# EAGLE design pcbqr_v3_error_as_made (EAGLE 5.11)

## Sheet 1 of 2
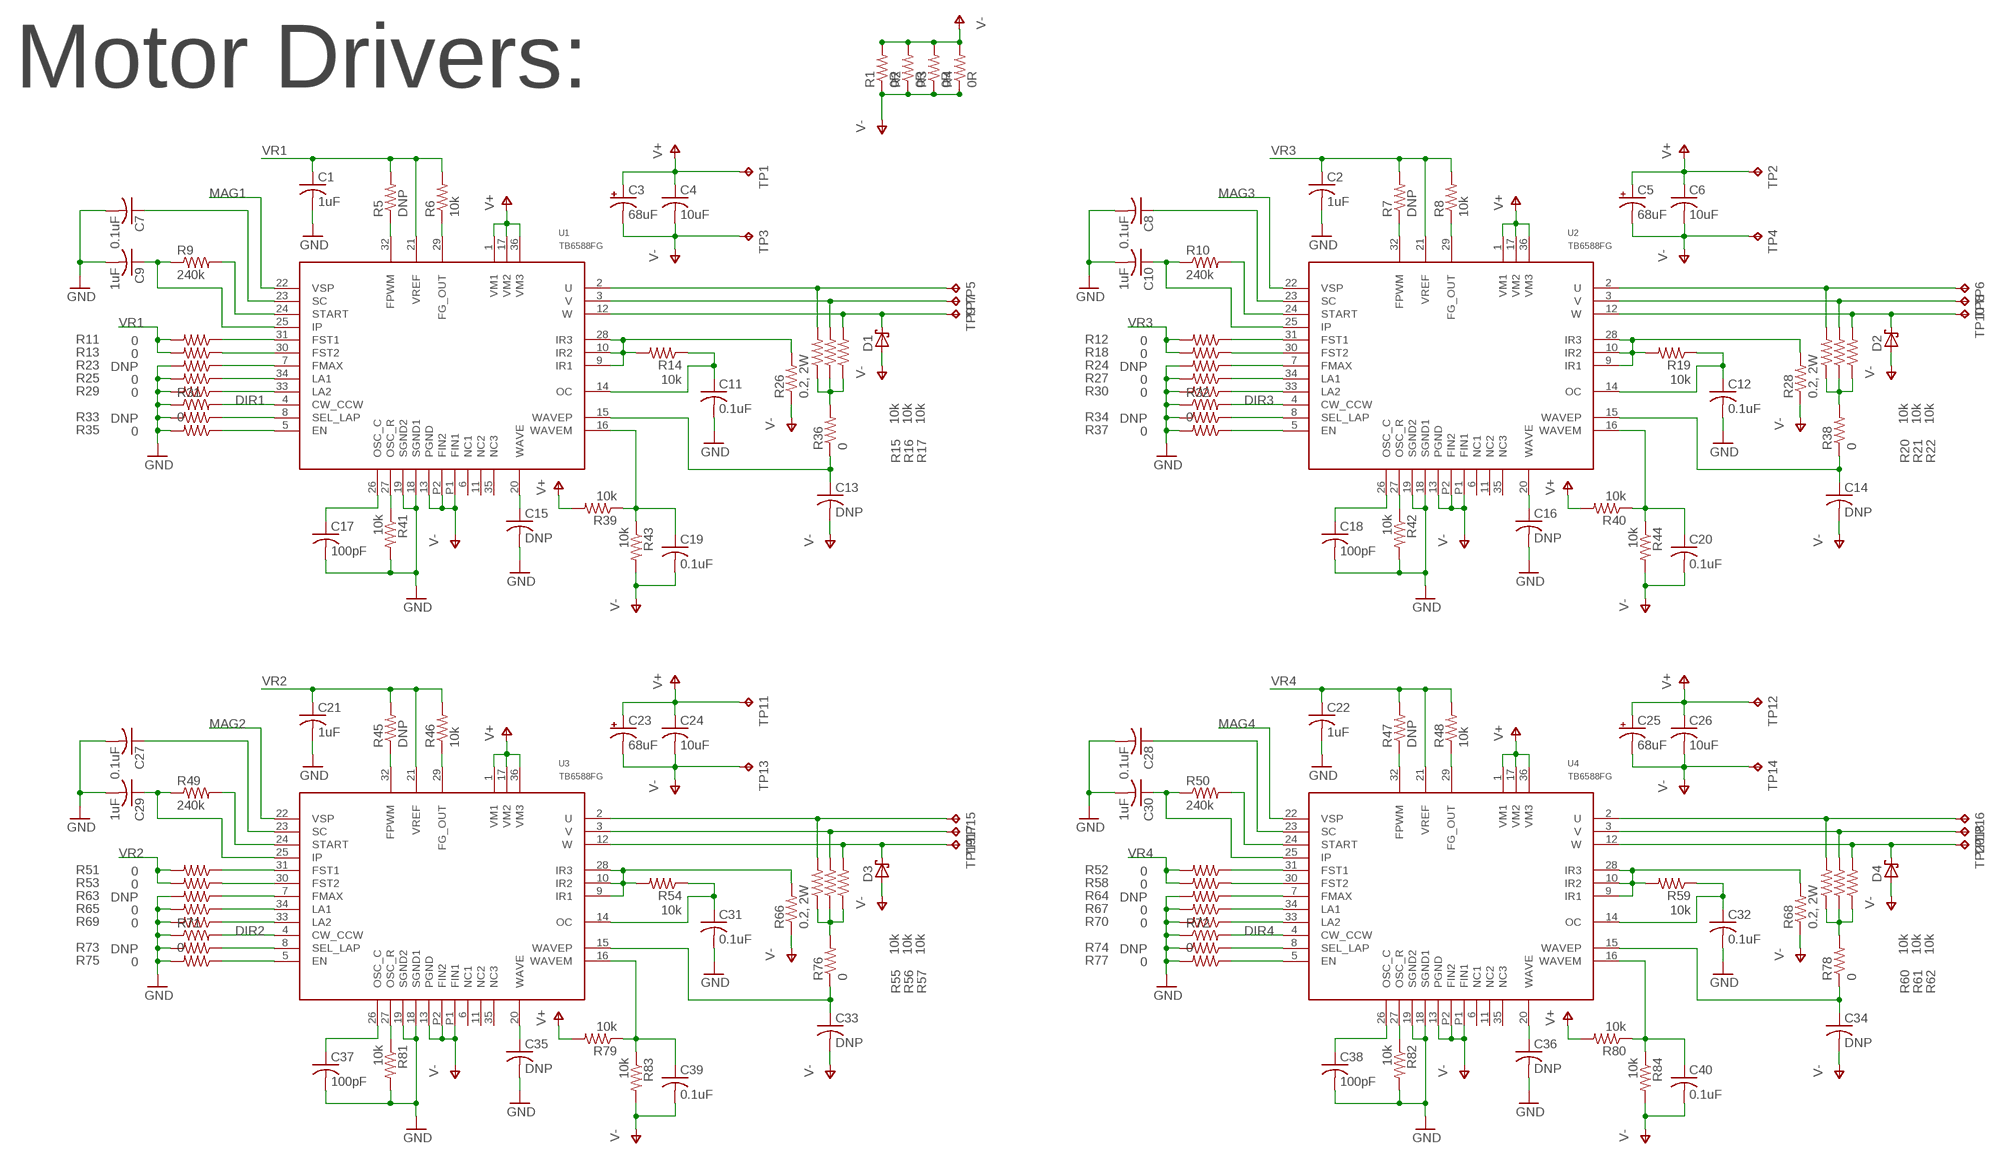
[diagram p0: schematic, sheet 1]

### Parts
C1  1uF  C-USC0603  [C0603]
C2  1uF  C-USC0603  [C0603]
C3  68uF  CPOL-USD  [PANASONIC_D]
C4  10uF  C-USC1206  [C1206]
C5  68uF  CPOL-USD  [PANASONIC_D]
C6  10uF  C-USC1206  [C1206]
C7  0.1uF  C-USC0603  [C0603]
C8  0.1uF  C-USC0603  [C0603]
C9  1uF  C-USC0603  [C0603]
C10  1uF  C-USC0603  [C0603]
C11  0.1uF  C-USC0603  [C0603]
C12  0.1uF  C-USC0603  [C0603]
C13  DNP  C-USC0603  [C0603]
C14  DNP  C-USC0603  [C0603]
C15  DNP  C-USC0603  [C0603]
C16  DNP  C-USC0603  [C0603]
C17  100pF  C-USC0603  [C0603]
C18  100pF  C-USC0603  [C0603]
C19  0.1uF  C-USC0603  [C0603]
C20  0.1uF  C-USC0603  [C0603]
C21  1uF  C-USC0603  [C0603]
C22  1uF  C-USC0603  [C0603]
C23  68uF  CPOL-USD  [PANASONIC_D]
C24  10uF  C-USC1206  [C1206]
C25  68uF  CPOL-USD  [PANASONIC_D]
C26  10uF  C-USC1206  [C1206]
C27  0.1uF  C-USC0603  [C0603]
C28  0.1uF  C-USC0603  [C0603]
C29  1uF  C-USC0603  [C0603]
C30  1uF  C-USC0603  [C0603]
C31  0.1uF  C-USC0603  [C0603]
C32  0.1uF  C-USC0603  [C0603]
C33  DNP  C-USC0603  [C0603]
C34  DNP  C-USC0603  [C0603]
C35  DNP  C-USC0603  [C0603]
C36  DNP  C-USC0603  [C0603]
C37  100pF  C-USC0603  [C0603]
C38  100pF  C-USC0603  [C0603]
C39  0.1uF  C-USC0603  [C0603]
C40  0.1uF  C-USC0603  [C0603]
D1  SCHOTTKY_SMA  [SMA]
D2  SCHOTTKY_SMA  [SMA]
D3  SCHOTTKY_SMA  [SMA]
D4  SCHOTTKY_SMA  [SMA]
R1  0R  R-US_R1210  [R1210]
R2  0R  R-US_R1210  [R1210]
R3  0R  R-US_R2010  [R2010]
R4  0R  R-US_R2010  [R2010]
R5  DNP  R-US_R0603  [R0603]
R6  10k  R-US_R0603  [R0603]
R7  DNP  R-US_R0603  [R0603]
R8  10k  R-US_R0603  [R0603]
R9  240k  R-US_R0603  [R0603]
R10  240k  R-US_R0603  [R0603]
R11  0  R-US_R0603  [R0603]
R12  0  R-US_R0603  [R0603]
R13  0  R-US_R0603  [R0603]
R14  10k  R-US_R0603  [R0603]
R15  10k  R-US_R0603  [R0603]
R16  10k  R-US_R0603  [R0603]
R17  10k  R-US_R0603  [R0603]
R18  0  R-US_R0603  [R0603]
R19  10k  R-US_R0603  [R0603]
R20  10k  R-US_R0603  [R0603]
R21  10k  R-US_R0603  [R0603]
R22  10k  R-US_R0603  [R0603]
R23  DNP  R-US_R0603  [R0603]
R24  DNP  R-US_R0603  [R0603]
R25  0  R-US_R0603  [R0603]
R26  0.2, 2W  R-US_R2512  [R2512]
R27  0  R-US_R0603  [R0603]
R28  0.2, 2W  R-US_R2512  [R2512]
R29  0  R-US_R0603  [R0603]
R30  0  R-US_R0603  [R0603]
R31  0  R-US_R0603  [R0603]
R32  0  R-US_R0603  [R0603]
R33  DNP  R-US_R0603  [R0603]
R34  DNP  R-US_R0603  [R0603]
R35  0  R-US_R0603  [R0603]
R36  0  R-US_R0603  [R0603]
R37  0  R-US_R0603  [R0603]
R38  0  R-US_R0603  [R0603]
R39  10k  R-US_R0603  [R0603]
R40  10k  R-US_R0603  [R0603]
R41  10k  R-US_R0603  [R0603]
R42  10k  R-US_R0603  [R0603]
R43  10k  R-US_R0603  [R0603]
R44  10k  R-US_R0603  [R0603]
R45  DNP  R-US_R0603  [R0603]
R46  10k  R-US_R0603  [R0603]
R47  DNP  R-US_R0603  [R0603]
R48  10k  R-US_R0603  [R0603]
R49  240k  R-US_R0603  [R0603]
R50  240k  R-US_R0603  [R0603]
R51  0  R-US_R0603  [R0603]
R52  0  R-US_R0603  [R0603]
R53  0  R-US_R0603  [R0603]
R54  10k  R-US_R0603  [R0603]
R55  10k  R-US_R0603  [R0603]
R56  10k  R-US_R0603  [R0603]
R57  10k  R-US_R0603  [R0603]
R58  0  R-US_R0603  [R0603]
R59  10k  R-US_R0603  [R0603]
R60  10k  R-US_R0603  [R0603]
R61  10k  R-US_R0603  [R0603]
R62  10k  R-US_R0603  [R0603]
R63  DNP  R-US_R0603  [R0603]
R64  DNP  R-US_R0603  [R0603]
R65  0  R-US_R0603  [R0603]
R66  0.2, 2W  R-US_R2512  [R2512]
R67  0  R-US_R0603  [R0603]
R68  0.2, 2W  R-US_R2512  [R2512]
R69  0  R-US_R0603  [R0603]
R70  0  R-US_R0603  [R0603]
R71  0  R-US_R0603  [R0603]
R72  0  R-US_R0603  [R0603]
R73  DNP  R-US_R0603  [R0603]
R74  DNP  R-US_R0603  [R0603]
R75  0  R-US_R0603  [R0603]
R76  0  R-US_R0603  [R0603]
R77  0  R-US_R0603  [R0603]
R78  0  R-US_R0603  [R0603]
R79  10k  R-US_R0603  [R0603]
R80  10k  R-US_R0603  [R0603]
R81  10k  R-US_R0603  [R0603]
R82  10k  R-US_R0603  [R0603]
R83  10k  R-US_R0603  [R0603]
R84  10k  R-US_R0603  [R0603]
TP1  TPTP20SQ  [TP20SQ]
TP2  TPTP20SQ  [TP20SQ]
TP3  TPTP20SQ  [TP20SQ]
TP4  TPTP20SQ  [TP20SQ]
TP5  TPTP20SQ  [TP20SQ]
TP6  TPTP20SQ  [TP20SQ]
TP7  TPTP20SQ  [TP20SQ]
TP8  TPTP20SQ  [TP20SQ]
TP9  TPTP20SQ  [TP20SQ]
TP10  TPTP20SQ  [TP20SQ]
TP11  TPTP20SQ  [TP20SQ]
TP12  TPTP20SQ  [TP20SQ]
TP13  TPTP20SQ  [TP20SQ]
TP14  TPTP20SQ  [TP20SQ]
TP15  TPTP20SQ  [TP20SQ]
TP16  TPTP20SQ  [TP20SQ]
TP17  TPTP20SQ  [TP20SQ]
TP18  TPTP20SQ  [TP20SQ]
TP19  TPTP20SQ  [TP20SQ]
TP20  TPTP20SQ  [TP20SQ]
U1  TB6588FG  [HSOP36-P-450-0.65]
U2  TB6588FG  [HSOP36-P-450-0.65]
U3  TB6588FG  [HSOP36-P-450-0.65]
U4  TB6588FG  [HSOP36-P-450-0.65]

### Nets
DIR1: R31.2 U1.4(CW_CCW)
DIR2: R71.2 U3.4(CW_CCW)
DIR3: R32.2 U2.4(CW_CCW)
DIR4: R72.2 U4.4(CW_CCW)
GND: C1.2 C2.2 C7.2 C8.2 C9.2 C10.2 C11.2 C12.2 C15.2 C16.2 C17.2 C18.2 C21.2 C22.2 C27.2 C28.2 C29.2 C30.2 C31.2 C32.2 C35.2 C36.2 C37.2 C38.2 R23.2 R24.2 R25.2 R27.2 R29.2 R30.2 R31.1 R32.1 R33.2 R34.2 R35.2 R37.2 R41.2 R42.2 R63.2 R64.2 R65.2 R67.2 R69.2 R70.2 R71.1 R72.1 R73.2 R74.2 R75.2 R77.2 R81.2 R82.2 U1.18(SGND1) U1.19(SGND2) U2.18(SGND1) U2.19(SGND2) U3.18(SGND1) U3.19(SGND2) U4.18(SGND1) U4.19(SGND2) ; also sheet 2
MAG1: U1.22(VSP) ; also sheet 2
MAG2: U3.22(VSP) ; also sheet 2
MAG3: U2.22(VSP) ; also sheet 2
MAG4: U4.22(VSP) ; also sheet 2
N$3: R15.1 R16.1 R17.1 R36.2
N$4: R14.2 R26.2 U1.9(IR1) U1.10(IR2) U1.28(IR3)
N$5: R15.2 TP5.TP U1.2(U)
N$6: R16.2 TP7.TP U1.3(V)
N$7: D1.C R17.2 TP9.TP U1.12(W)
N$8: R35.1 U1.5(EN)
N$9: R33.1 U1.8(SEL_LAP)
N$10: R9.2 U1.24(START)
N$11: R29.1 U1.33(LA2)
N$12: R25.1 U1.34(LA1)
N$13: R23.1 U1.7(FMAX)
N$14: C17.1 U1.26(OSC_C)
N$15: R41.1 U1.27(OSC_R)
N$16: R13.1 U1.30(FST2)
N$17: R11.1 U1.31(FST1)
N$18: C9.1 R9.1 U1.25(IP)
N$19: R5.1 U1.32(FPWM)
N$20: C7.1 U1.23(SC)
N$21: R6.1 U1.29(FG_OUT)
N$22: C19.1 R39.1 R43.1 U1.16(WAVEM)
N$23: R54.2 R66.2 U3.9(IR1) U3.10(IR2) U3.28(IR3)
N$24: C13.1 R36.1 U1.15(WAVEP)
N$25: C11.1 R14.1 U1.14(OC)
N$26: C15.1 U1.20(WAVE)
N$27: R55.2 TP15.TP U3.2(U)
N$28: R56.2 TP17.TP U3.3(V)
N$29: D3.C R57.2 TP19.TP U3.12(W)
N$30: R75.1 U3.5(EN)
N$31: R73.1 U3.8(SEL_LAP)
N$32: R69.1 U3.33(LA2)
N$33: R65.1 U3.34(LA1)
N$34: R63.1 U3.7(FMAX)
N$35: C37.1 U3.26(OSC_C)
N$36: R81.1 U3.27(OSC_R)
N$37: R53.1 U3.30(FST2)
N$38: R51.1 U3.31(FST1)
N$39: R49.2 U3.24(START)
N$40: C29.1 R49.1 U3.25(IP)
N$41: C27.1 U3.23(SC)
N$42: R45.1 U3.32(FPWM)
N$43: R46.1 U3.29(FG_OUT)
N$44: R55.1 R56.1 R57.1 R76.2
N$45: C33.1 R76.1 U3.15(WAVEP)
N$46: C31.1 R54.1 U3.14(OC)
N$47: C39.1 R79.1 R83.1 U3.16(WAVEM)
N$48: C35.1 U3.20(WAVE)
N$49: R19.2 R28.2 U2.9(IR1) U2.10(IR2) U2.28(IR3)
N$50: R20.2 TP6.TP U2.2(U)
N$51: R21.2 TP8.TP U2.3(V)
N$52: D2.C R22.2 TP10.TP U2.12(W)
N$53: R37.1 U2.5(EN)
N$54: R34.1 U2.8(SEL_LAP)
N$55: R30.1 U2.33(LA2)
N$56: R27.1 U2.34(LA1)
N$57: R24.1 U2.7(FMAX)
N$58: C18.1 U2.26(OSC_C)
N$59: R42.1 U2.27(OSC_R)
N$60: R18.1 U2.30(FST2)
N$61: R12.1 U2.31(FST1)
N$62: R10.2 U2.24(START)
N$63: C10.1 R10.1 U2.25(IP)
N$64: C8.1 U2.23(SC)
N$65: R7.1 U2.32(FPWM)
N$66: R8.1 U2.29(FG_OUT)
N$67: R20.1 R21.1 R22.1 R38.2
N$68: C14.1 R38.1 U2.15(WAVEP)
N$69: C12.1 R19.1 U2.14(OC)
N$70: C20.1 R40.1 R44.1 U2.16(WAVEM)
N$71: C16.1 U2.20(WAVE)
N$72: R59.2 R68.2 U4.9(IR1) U4.10(IR2) U4.28(IR3)
N$73: R60.2 TP16.TP U4.2(U)
N$74: R61.2 TP18.TP U4.3(V)
N$75: D4.C R62.2 TP20.TP U4.12(W)
N$76: R77.1 U4.5(EN)
N$77: R74.1 U4.8(SEL_LAP)
N$78: R70.1 U4.33(LA2)
N$79: R67.1 U4.34(LA1)
N$80: R64.1 U4.7(FMAX)
N$81: C38.1 U4.26(OSC_C)
N$82: R82.1 U4.27(OSC_R)
N$83: R58.1 U4.30(FST2)
N$84: R52.1 U4.31(FST1)
N$85: R50.2 U4.24(START)
N$86: C30.1 R50.1 U4.25(IP)
N$87: C28.1 U4.23(SC)
N$88: R47.1 U4.32(FPWM)
N$89: R48.1 U4.29(FG_OUT)
N$90: R60.1 R61.1 R62.1 R78.2
N$91: C34.1 R78.1 U4.15(WAVEP)
N$92: C32.1 R59.1 U4.14(OC)
N$93: C40.1 R80.1 R84.1 U4.16(WAVEM)
N$94: C36.1 U4.20(WAVE)
V+: C3.+ C4.1 C5.+ C6.1 C23.+ C24.1 C25.+ C26.1 R39.2 R40.2 R79.2 R80.2 TP1.TP TP2.TP TP11.TP TP12.TP U1.1(VM1) U1.17(VM2) U1.36(VM3) U2.1(VM1) U2.17(VM2) U2.36(VM3) U3.1(VM1) U3.17(VM2) U3.36(VM3) U4.1(VM1) U4.17(VM2) U4.36(VM3) ; also sheet 2
V-: C3.- C4.2 C5.- C6.2 C13.2 C14.2 C19.2 C20.2 C23.- C24.2 C25.- C26.2 C33.2 C34.2 C39.2 C40.2 D1.A D2.A D3.A D4.A R1.1 R1.2 R2.1 R2.2 R3.1 R3.2 R4.1 R4.2 R26.1 R28.1 R43.2 R44.2 R66.1 R68.1 R83.2 R84.2 TP3.TP TP4.TP TP13.TP TP14.TP U1.13(PGND) U1.P1(FIN1) U1.P2(FIN2) U2.13(PGND) U2.P1(FIN1) U2.P2(FIN2) U3.13(PGND) U3.P1(FIN1) U3.P2(FIN2) U4.13(PGND) U4.P1(FIN1) U4.P2(FIN2) ; also sheet 2
VR1: C1.1 R5.2 R6.2 R11.2 R13.2 U1.21(VREF)
VR2: C21.1 R45.2 R46.2 R51.2 R53.2 U3.21(VREF)
VR3: C2.1 R7.2 R8.2 R12.2 R18.2 U2.21(VREF)
VR4: C22.1 R47.2 R48.2 R52.2 R58.2 U4.21(VREF)
Unconnected: U1.6(NC1) U1.11(NC2) U1.35(NC3) U2.6(NC1) U2.11(NC2) U2.35(NC3) U3.6(NC1) U3.11(NC2) U3.35(NC3) U4.6(NC1) U4.11(NC2) U4.35(NC3)

### Notes on the sheet
- Motor Drivers:

## Sheet 2 of 2
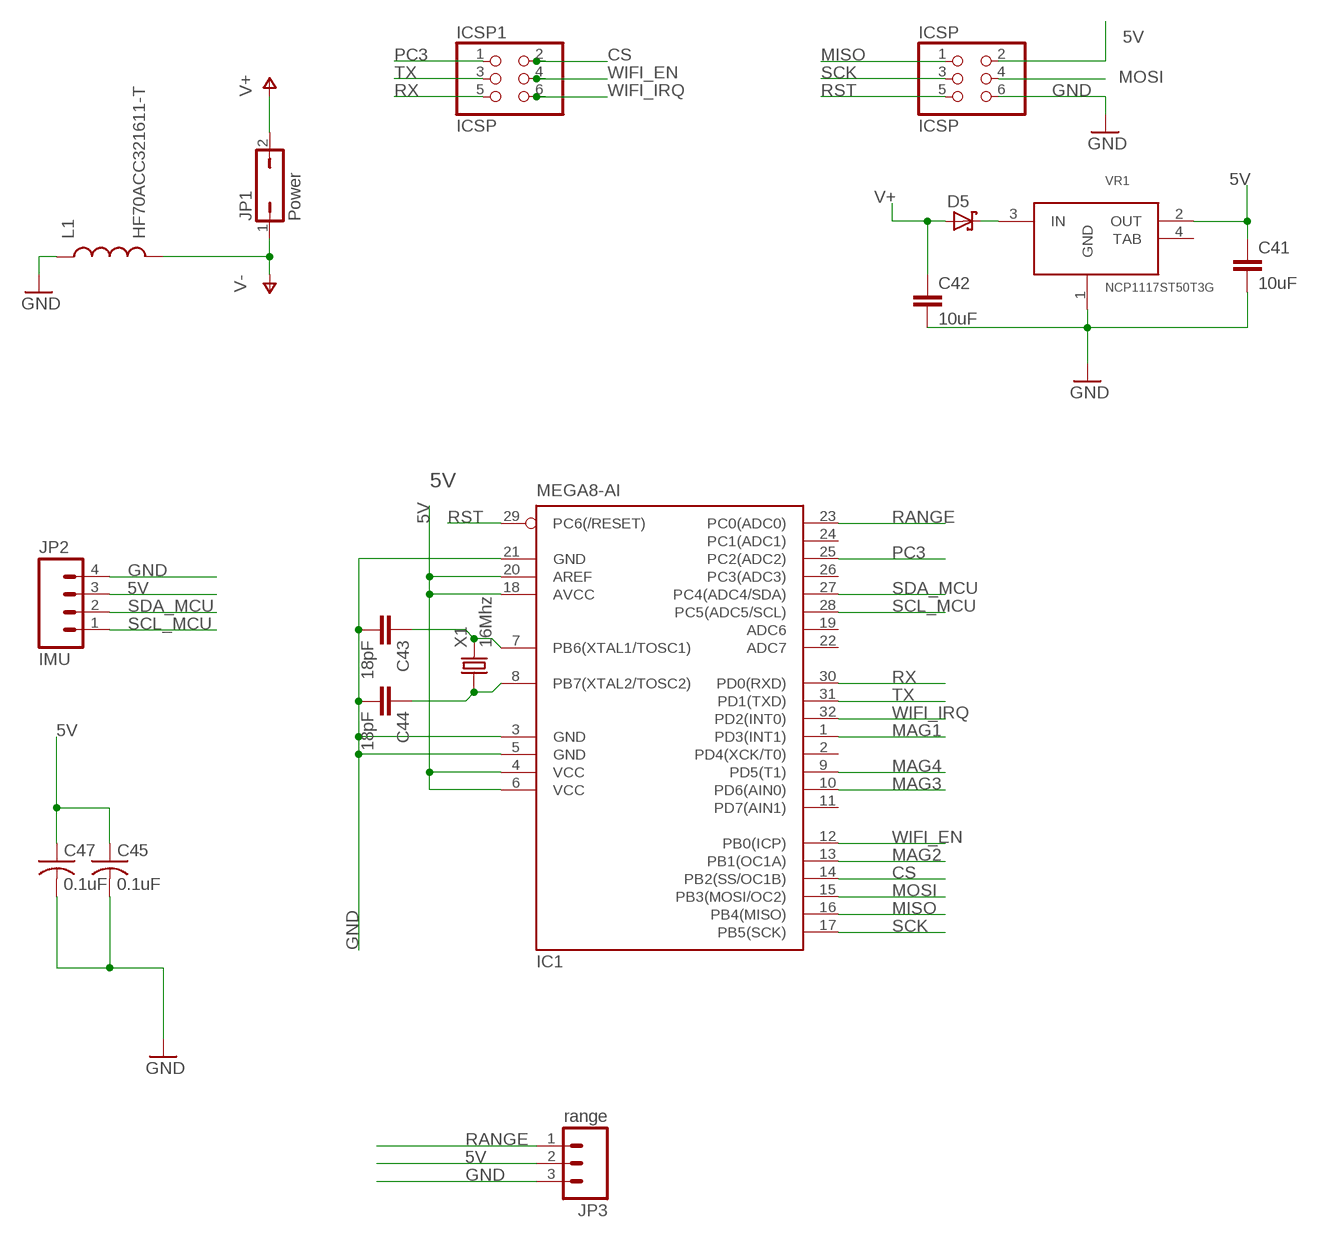
[diagram p1: schematic, sheet 2]

### Parts
C41  10uF  CAP0805  [0805]
C42  10uF  CAP0805  [0805]
C43  18pF  CAP0805  [0805]
C44  18pF  CAP0805  [0805]
C45  0.1uF  C-USC0603  [C0603]
C47  0.1uF  C-USC0603  [C0603]
D5  SCHOTTKY_SMA  [SMA]
IC1  MEGA8-AI  [TQFP32-08]
ICSP  ICSP  PINHD-2X3  [2X03]
ICSP1  ICSP  PINHD-2X3  [2X03]
JP1  Power  JP1Q  [JP1]
JP2  IMU  M04PTH  [1X04]
JP3  range  M03POLAR  [MOLEX-1X3]
L1  HF70ACC321611-T  INDUCTOR1206H*  [INDUCTOR-1206]
VR1  NCP1117ST50T3G  LM1117  [SOT-223]
X1  16Mhz  CRYSTAL-5032  [5032]

### Nets
5V: C41.1 C45.1 C47.1 IC1.4(VCC) IC1.6(VCC) IC1.18(AVCC) IC1.20(AREF) ICSP.2 JP2.3 JP3.2 VR1.2(OUT)
CS: IC1.14(PB2(SS/OC1B)) ICSP1.2
GND: C41.2 C42.2 C43.2 C44.2 C45.2 C47.2 IC1.3(GND) IC1.5(GND) IC1.21(GND) ICSP.6 JP2.4 JP3.3 L1.P$1 VR1.1(GND) ; also sheet 1
MAG1: IC1.1(PD3(INT1)) ; also sheet 1
MAG2: IC1.13(PB1(OC1A)) ; also sheet 1
MAG3: IC1.10(PD6(AIN0)) ; also sheet 1
MAG4: IC1.9(PD5(T1)) ; also sheet 1
MISO: IC1.16(PB4(MISO)) ICSP.1
MOSI: IC1.15(PB3(MOSI/OC2)) ICSP.4
N$2: C43.1 IC1.7(PB6(XTAL1/TOSC1)) X1.2
N$95: C44.1 IC1.8(PB7(XTAL2/TOSC2)) X1.1
N$96: D5.C VR1.3(IN)
PC3: IC1.25(PC2(ADC2)) ICSP1.1
RANGE: IC1.23(PC0(ADC0)) JP3.1
RST: IC1.29(PC6(/RESET)) ICSP.5
RX: IC1.30(PD0(RXD)) ICSP1.5
SCK: IC1.17(PB5(SCK)) ICSP.3
SCL_MCU: IC1.28(PC5(ADC5/SCL)) JP2.1
SDA_MCU: IC1.27(PC4(ADC4/SDA)) JP2.2
TX: IC1.31(PD1(TXD)) ICSP1.3
V+: C42.1 D5.A JP1.2 ; also sheet 1
V-: JP1.1 L1.P$2 ; also sheet 1
WIFI_EN: IC1.12(PB0(ICP)) ICSP1.4
WIFI_IRQ: IC1.32(PD2(INT0)) ICSP1.6
Unconnected: IC1.2(PD4(XCK/T0)) IC1.11(PD7(AIN1)) IC1.19(ADC6) IC1.22(ADC7) IC1.24(PC1(ADC1)) IC1.26(PC3(ADC3)) VR1.4(TAB)

## Library data of the parts
C1 C2 C4 C6-C22 C24 C26-C40 C45 C47 = rcl:C-US: CAPACITOR, American symbol
C3 C5 C23 C25 = rcl:CPOL-US: POLARIZED CAPACITOR, American symbol
C41 C42 = SparkFun:CAP: Capacitor Standard 0603 ceramic capacitor, and 0.1" leaded capacitor.
C43 C44 = slice_noshift:CAP: Capacitor Standard 0603 ceramic capacitor, and 0.1" leaded capacitor.
D1-D5 = sc_usercreated:SCHOTTKY_SMA
IC1 = atmel:MEGA8: MICROCONTROLLER 8 Kbytes FLASH, 1 kbytes SRAM, 512 bytes EEPROM, USART, 6-channel 10 bit ADC, 2-channel 8 bit ADC Pin compatible with Atmega48, ATMega88, ATMega168 Source: avr.lbr; MPN: ATMEGA8-16AU; OC_FARNELL: 9171371; OC_NEWARK: 73M8863
ICSP ICSP1 = pinhead:PINHD-2X3: PIN HEADER
JP1 = jumper:JP1Q: JUMPER
JP2 = SparkFun:M04: Header 4 Standard 4-pin 0.1" header. Use with straight break away headers (SKU : PRT-00116), right angle break away headers (PRT-00553), swiss pins (PRT-00743), machine pins (PRT-00117), and female headers (PRT-00115). Molex polarized connector foot print use with SKU : PRT-08231 with associated crimp pins and housings. 1MM SMD Version SKU: PRT-10208
JP3 = SparkFun:M03: Header 3 Standard 3-pin 0.1" header. Use with straight break away headers (SKU : PRT-00116), right angle break away headers (PRT-00553), swiss pins (PRT-00743), machine pins (PRT-00117), and female headers (PRT-00115). Molex polarized connector foot print use with SKU : PRT-08232 with associated crimp pins and housings.
L1 = SparkFun:INDUCTOR: Inductors Basic Inductor/Choke - 0603 and 1206. Footprints are not proven and vary greatly between part numbers.
R1-R84 = rcl:R-US_: RESISTOR, American symbol
TP1-TP20 = testpad:TP: Test pad
U1-U4 = sc_usercreated:TB6588FG
VR1 = sc_usercreated:LM1117
X1 = NSL_MiniQuad:CRYSTAL*: CRYSTAL

## Net classes
0 default: width 0.203 mm, drill 0.381 mm, clearance 0.203 mm
1 power: width 0.254 mm, drill 0.381 mm, clearance 0.203 mm
3 usbvcc: width 0.508 mm, drill 0.381 mm, clearance 0.203 mm

## Board
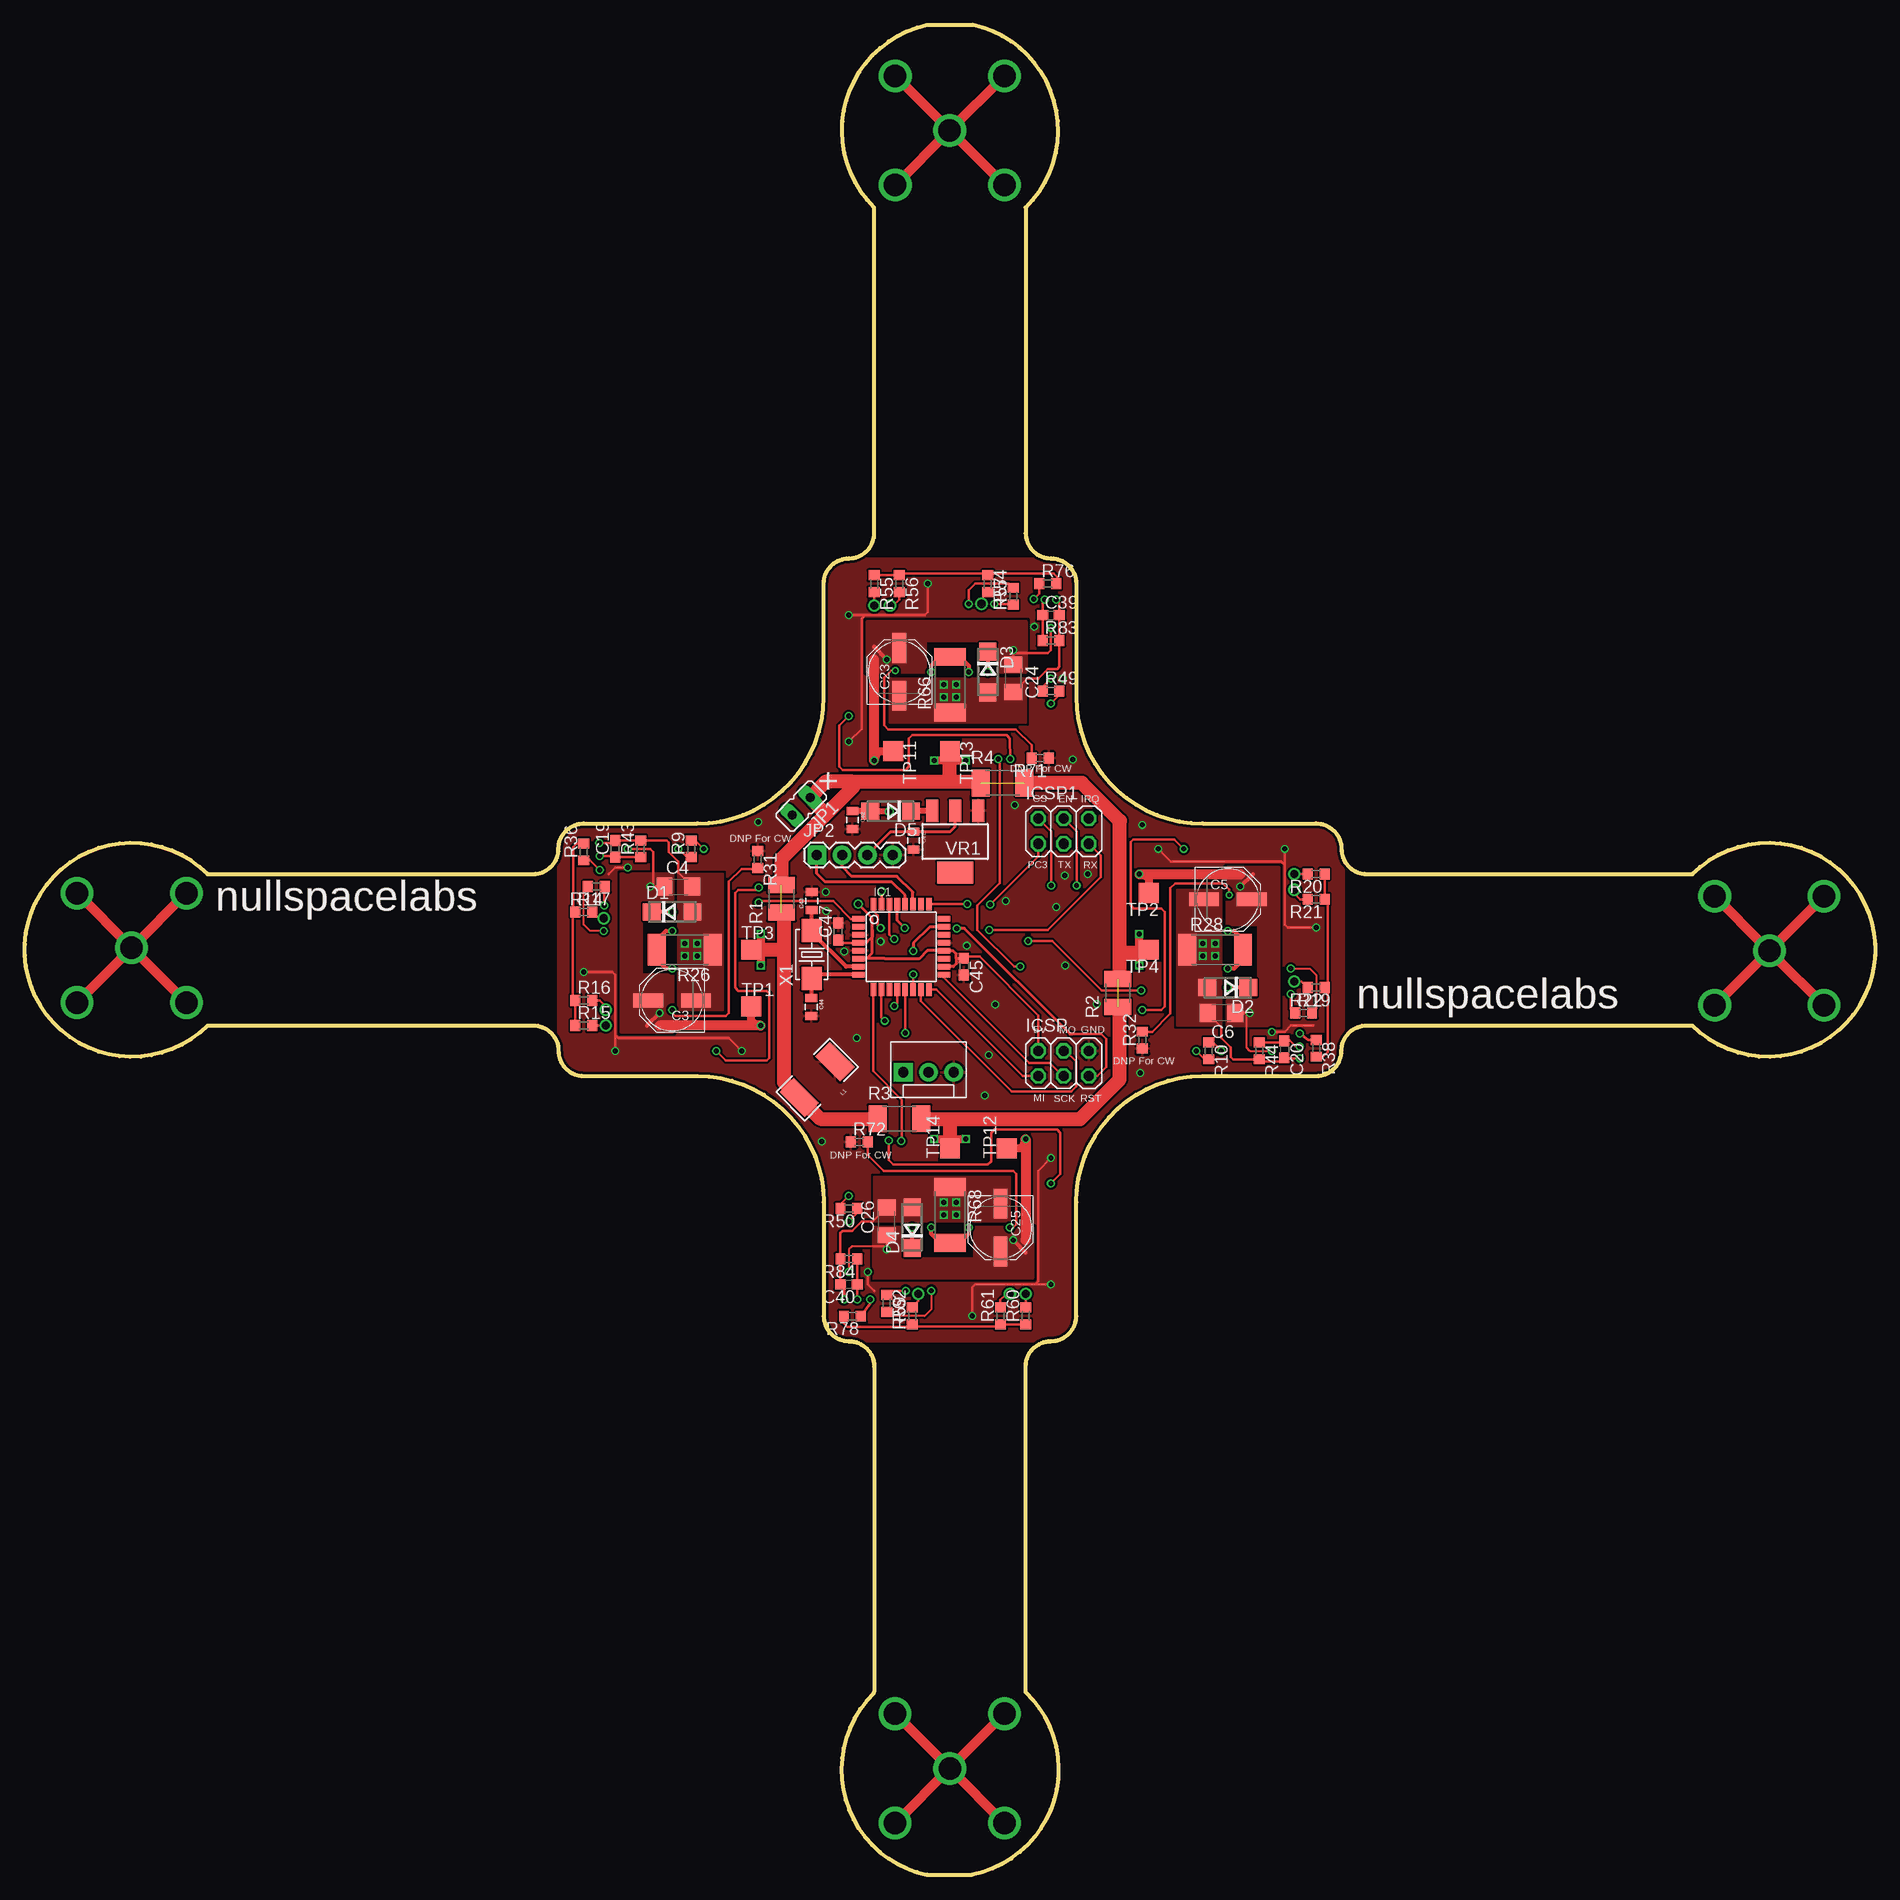
[diagram p2: board, top side]
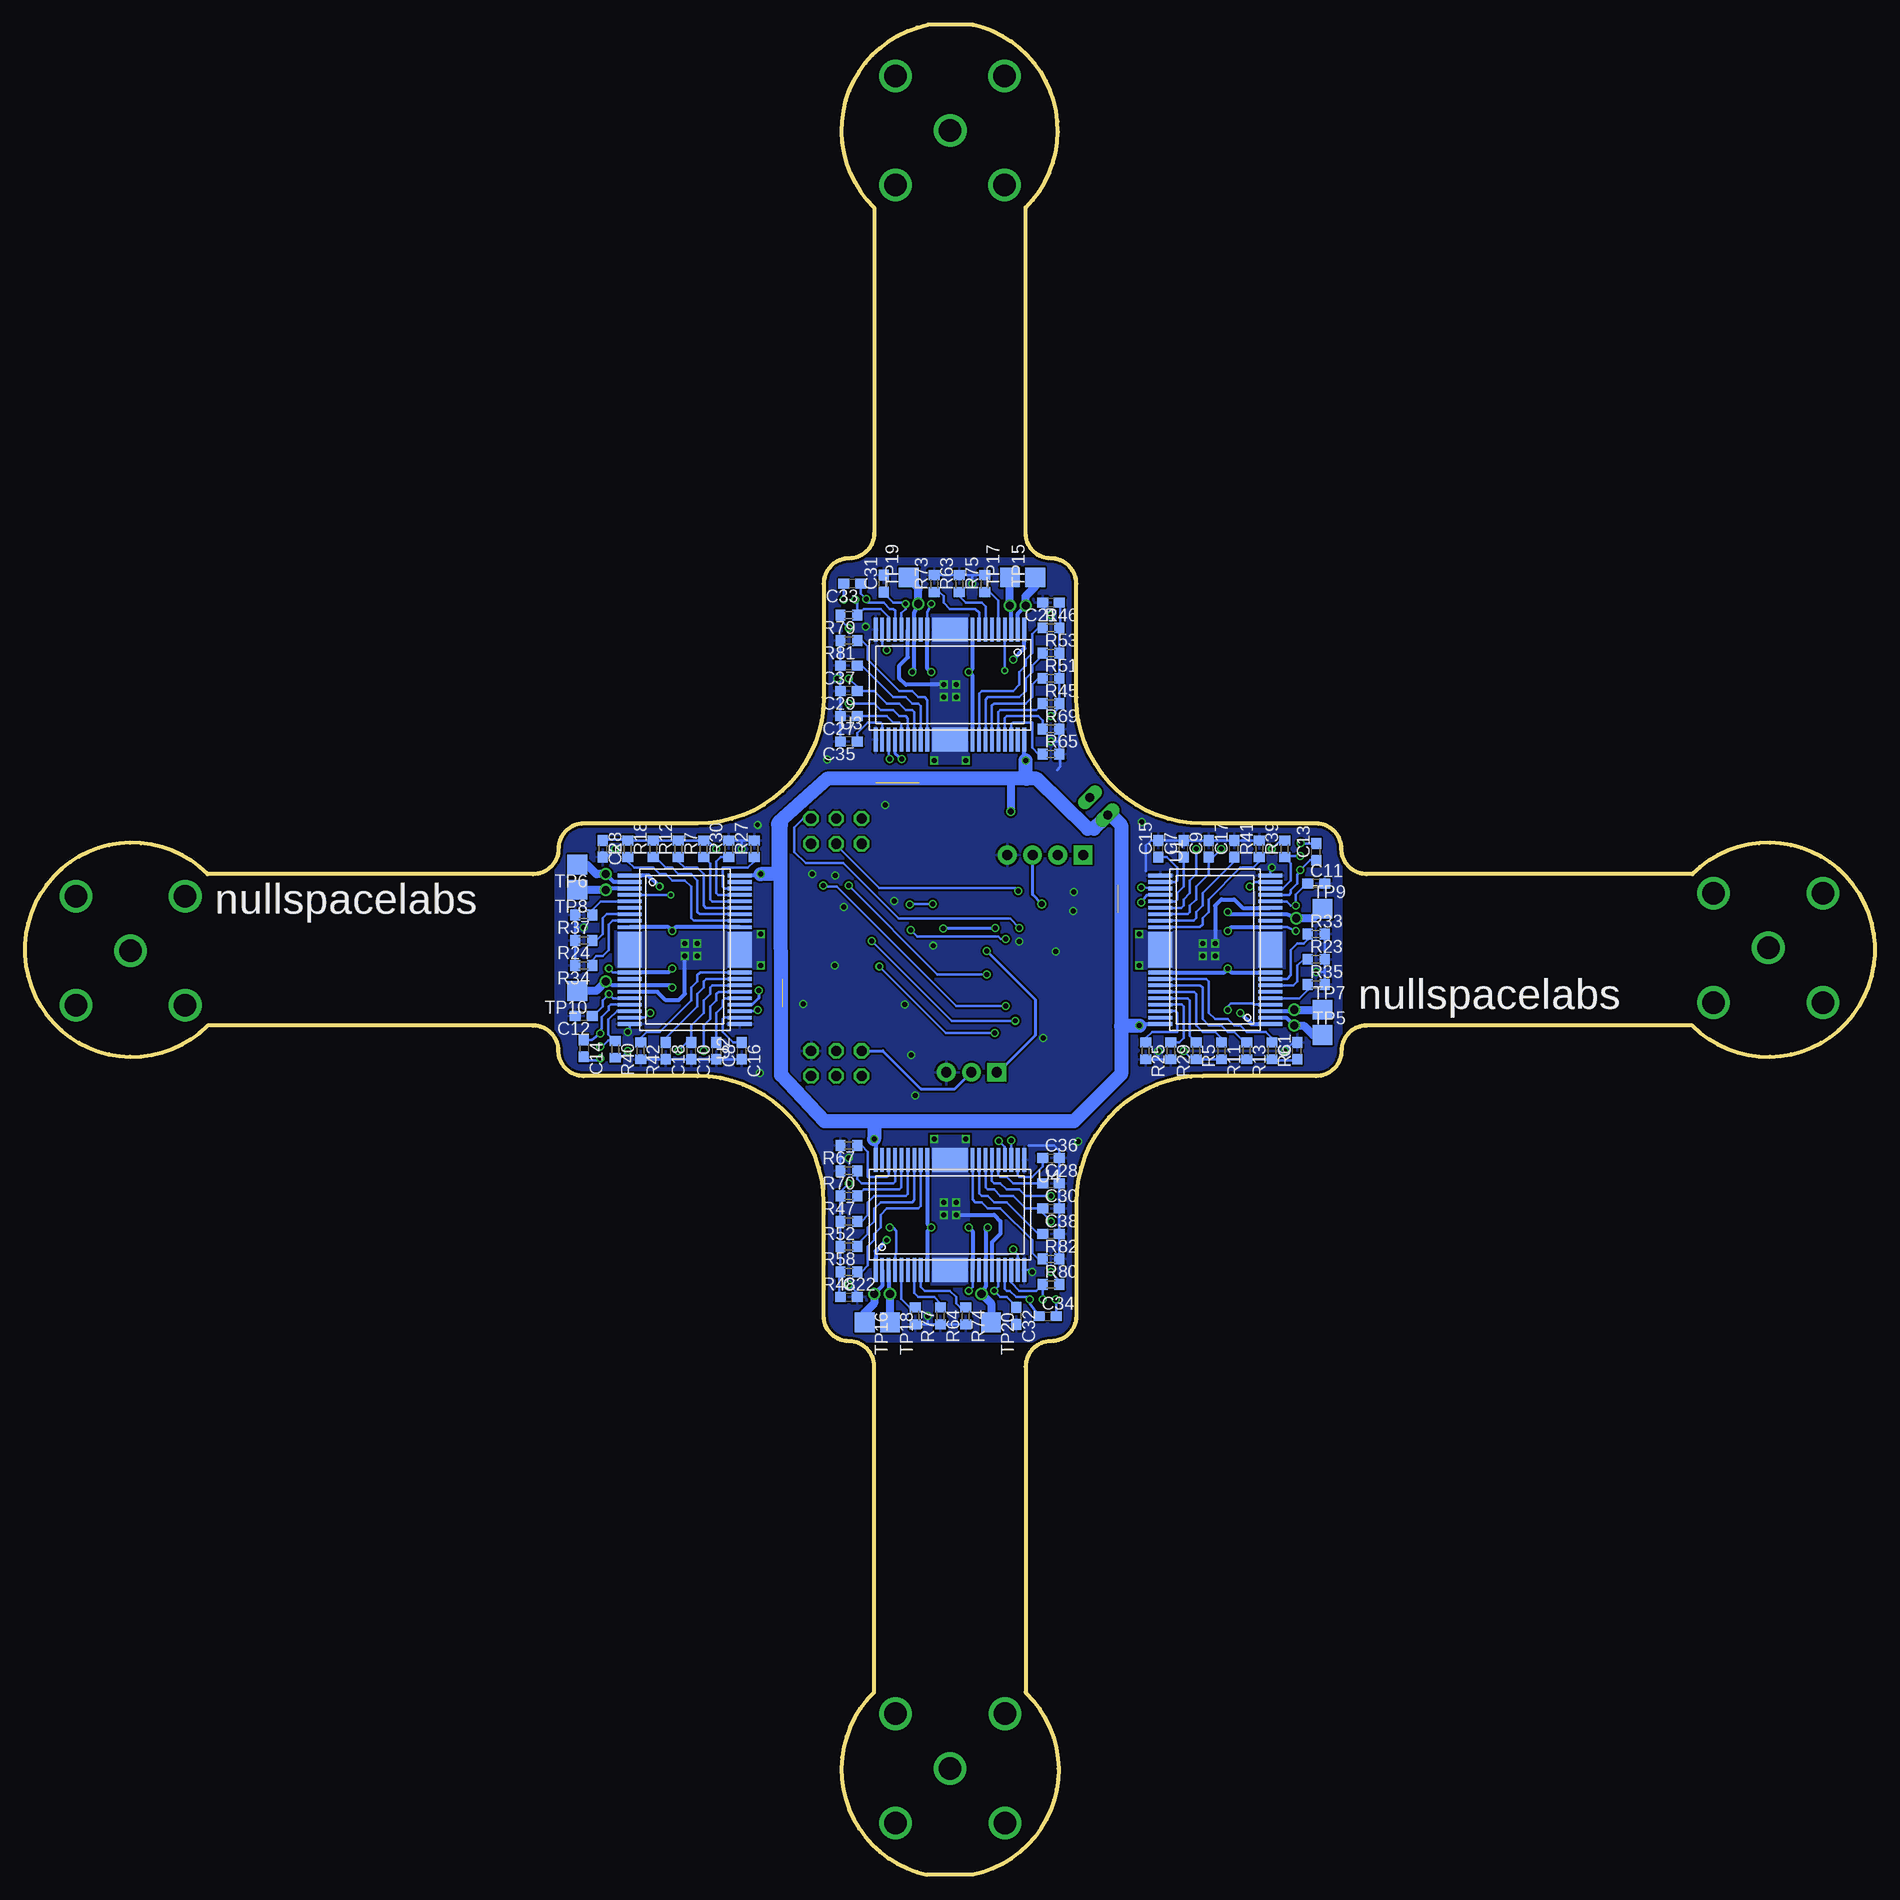
[diagram p3: board, bottom side, seen from below]

Size 186.07 x 186.08 mm. Coordinates in mm from the lower left corner, seen from the top.
Outline: 85.41,18.39 85.41,51.13 arc90 82.87,53.67 arc-90 80.33,56.21 80.33,67.64 arc90 67.63,80.34 56.2,80.34 arc-90 53.66,82.88 arc90 51.12,85.42 18.38,85.42 arc-270 18.38,100.66 51.12,100.66 arc90 53.66,103.2 arc-90 56.2,105.74 67.63,105.74 arc90 80.33,118.44 80.33,129.87 arc-90 82.87,132.41 arc90 85.41,134.95 85.41,167.69 arc-123 90.72,186.08 95.29,186.08 arc-124 100.65,167.69 100.65,134.95 arc90 103.19,132.41 arc-90 105.73,129.87 105.73,118.44 arc90 118.43,105.74 129.86,105.74 arc-90 132.4,103.2 arc90 134.94,100.66 167.68,100.66 arc-270 167.68,85.42 134.94,85.42 arc90 132.4,82.88 arc-90 129.86,80.34 118.43,80.34 arc90 105.73,67.64 105.73,56.21 arc-90 103.19,53.67 arc90 100.65,51.13 100.65,18.39
Outline: 85.36,18.26 arc124 90.72,0 95.29,0 arc124 100.65,18.36
Copper layers (1*16): Top 0.035mm / dielectric 1.5mm / Bottom 0.035mm
Design rules "ITead_rule *": minimum track width 6mil, minimum drill 12mil, track to track 6mil, track to pad 6mil, pad to pad 6mil, via to via 6mil, smd to smd 0mil, copper to edge 10mil, drill to drill 10mil, minimum pad ring 10mil, minimum via ring 6mil, stop-mask expansion 2mil, vias tented up to drill 14mil, thermal gap 10mil

### Footprints (pad centres in the part's own frame; a part is rotated, then mirrored left to right if it is on the bottom)
C0603 = smd 1.1 x 1: 1 -0.85,0; 2 0.85,0
PANASONIC_D = smd 3 x 1.4: + 2.4,0; - -2.4,0
C1206 = smd 1.6 x 1.8: 1 -1.4,0; 2 1.4,0
0805 = smd 0.8 x 1.2: 1 -0.9,0; 2 0.9,0
SMA = smd 1.8 x 1.7: A 2.05,0; C -2.05,0
TQFP32-08 = smd 1.27 x 0.559: 1 -4.293,2.8; 2 -4.293,2; 3 -4.293,1.2; 4 -4.293,0.4; 5 -4.293,-0.4; 6 -4.293,-1.2; 7 -4.293,-2; 8 -4.293,-2.8; 17 4.293,-2.8; 18 4.293,-2; 19 4.293,-1.2; 20 4.293,-0.4; 21 4.293,0.4; 22 4.293,1.2; 23 4.293,2; 24 4.293,2.8 | smd 0.559 x 1.27: 9 -2.8,-4.293; 10 -2,-4.293; 11 -1.2,-4.293; 12 -0.4,-4.293; 13 0.4,-4.293; 14 1.2,-4.293; 15 2,-4.293; 16 2.8,-4.293; 25 2.8,4.293; 26 2,4.293; 27 1.2,4.293; 28 0.4,4.293; 29 -0.4,4.293; 30 -1.2,4.293; 31 -2,4.293; 32 -2.8,4.293
2X03 = drill 1.016 octagon: 1 -2.54,-1.27; 2 -2.54,1.27; 3 0,-1.27; 4 0,1.27; 5 2.54,-1.27; 6 2.54,1.27
JP1 = drill 0.914 long: 1 0,-1.27; 2 0,1.27
1X04 = drill 1.016 pad 1.88 square: 1 0,0 | drill 1.016 pad 1.88 round: 2 2.54,0; 3 5.08,0; 4 7.62,0
MOLEX-1X3 = drill 1.016 pad 1.88 square: 1 0,0 | drill 1.016 pad 1.88 round: 2 2.54,0; 3 5.08,0
INDUCTOR-1206 = smd 2.032 x 3.556: P$1 -2.54,0; P$2 2.54,0
R1210 = smd 1.6 x 2.7: 1 -1.4,0; 2 1.4,0
R2010 = smd 1.8 x 2.7: 1 -2.2,0; 2 2.2,0
R0603 = smd 1 x 1.1: 1 -0.85,0; 2 0.85,0
R2512 = smd 1.8 x 3.2: 1 -2.8,0; 2 2.8,0
TP20SQ = smd 2 x 2: TP 0,0
HSOP36-P-450-0.65 = smd 0.38 x 2.4: 1 -7.475,-5.525; 2 -6.825,-5.525; 3 -6.175,-5.525; 4 -5.525,-5.525; 5 -4.875,-5.525; 6 -4.225,-5.525; 7 -3.575,-5.525; 8 -2.925,-5.525; 9 -2.275,-5.525; 10 2.275,-5.525; 11 2.925,-5.525; 12 3.575,-5.525; 13 4.225,-5.525; 14 4.875,-5.525; 15 5.525,-5.525; 16 6.175,-5.525; 17 6.825,-5.525; 18 7.475,-5.525; 19 7.475,5.525; 20 6.825,5.525; 21 6.175,5.525; 22 5.525,5.525; 23 4.875,5.525; 24 4.225,5.525; 25 3.575,5.525; 26 2.925,5.525; 27 2.275,5.525; 28 -2.275,5.525; 29 -2.925,5.525; 30 -3.575,5.525; 31 -4.225,5.525; 32 -4.875,5.525; 33 -5.525,5.525; 34 -6.175,5.525; 35 -6.825,5.525; 36 -7.475,5.525 | smd 3.6 x 2.4: P1 0,-5.525; P2 0,5.525
SOT-223 = smd 1.219 x 2.235: 1 -2.311,-3.099; 2 0,-3.099; 3 2.311,-3.099 | smd 3.6 x 2.2: 4 0,3.099
5032 = smd 2.286 x 2.032: 1 -2.413,0; 2 2.413,0

### Placement (x,y rotation side)
C1  58.11,82.88 90 bottom
C2  127.96,103.2 270 bottom
C3  65.09,87.96 180 top
C4  65.73,99.39 0 top
C5  120.97,98.12 0 top
C6  120.34,86.69 180 top
C7  69.54,103.2 90 bottom
C8  116.53,82.88 270 bottom
C9  67,103.2 90 bottom
C10  119.07,82.88 270 bottom
C11  56.2,99.71 0 bottom
C12  129.86,86.37 180 bottom
C13  56.2,102.9 90 bottom
C14  129.86,83.13 270 bottom
C15  72.08,103.2 90 bottom
C16  113.99,82.88 270 bottom
C17  64.46,103.2 90 bottom
C18  121.61,82.88 270 bottom
C19  59.38,103.2 90 top
C20  126.66,83.03 270 top
C21  82.87,127.97 180 bottom
C22  103.19,58.12 0 bottom
C23  87.95,120.98 90 top
C24  99.38,120.35 270 top
C25  98.11,65.1 270 top
C26  86.68,65.74 90 top
C27  103.19,116.54 180 bottom
C28  82.87,69.55 0 bottom
C29  103.19,119.08 180 bottom
C30  82.87,67.01 0 bottom
C31  99.7,129.87 90 bottom
C32  86.37,56.21 270 bottom
C33  102.86,129.87 180 bottom
C34  83.2,56.18 0 bottom
C35  103.19,114 180 bottom
C36  82.87,72.09 0 bottom
C37  103.19,121.62 180 bottom
C38  82.87,64.47 0 bottom
C39  103.19,126.7 0 top
C40  82.87,59.39 180 top
C41  89.36,104.01 270 top
C42  83.23,106.1 270 top
C43  79.11,97.94 90 top
C44  79.06,87.27 270 top
C45  94.43,91.34 270 top
C47  81.81,94.87 90 top
D1  65.09,96.85 0 top
D2  120.97,89.23 180 top
D3  96.84,120.98 270 top
D4  89.22,65.1 90 top
D5  87.06,107.01 180 top
IC1  88.13,93.34 0 top
ICSP  104.46,81.61 0 top
ICSP1  104.46,104.98 0 top
JP1  78.06,107.48 135 top
JP2  79.65,102.57 0 top
JP3  88.33,80.72 0 top
L1  79.67,79.98 225 top
R1  76.09,98.17 90 top
R2  109.9,88.7 90 top
R3  87.95,76.05 0 top
R4  98.32,109.83 0 top
R5  68.27,82.88 270 bottom
R6  60.65,82.88 270 bottom
R7  117.8,103.2 90 bottom
R8  125.42,103.2 90 bottom
R9  67,103.2 90 top
R10  119.07,82.88 270 top
R11  65.73,82.88 270 bottom
R12  120.34,103.2 90 bottom
R13  63.19,82.88 270 bottom
R14  57.47,99.39 180 top
R15  56.2,85.42 0 top
R16  56.2,87.96 0 top
R17  56.2,96.85 0 top
R18  122.88,103.2 90 bottom
R19  128.59,86.69 0 top
R20  129.86,100.66 180 top
R21  129.86,98.12 180 top
R22  129.86,89.23 180 top
R23  56.2,92.09 0 bottom
R24  129.86,93.99 180 bottom
R25  73.35,82.88 270 bottom
R26  66.36,93.04 180 top
R27  112.72,103.2 90 bottom
R28  119.7,93.04 0 top
R29  70.81,82.88 270 bottom
R30  115.26,103.2 90 bottom
R31  73.7,102.13 270 top
R32  112.39,83.95 90 top
R33  56.2,94.63 0 bottom
R34  129.86,91.45 180 bottom
R35  56.2,89.55 0 bottom
R36  56.2,102.9 90 top
R37  129.86,96.53 180 bottom
R38  129.86,83.13 270 top
R39  59.38,103.2 90 bottom
R40  126.69,83.03 270 bottom
R41  61.92,103.2 90 bottom
R42  124.15,82.88 270 bottom
R43  61.92,103.2 90 top
R44  124.15,82.88 270 top
R45  82.87,117.81 0 bottom
R46  82.87,125.43 0 bottom
R47  103.19,68.28 180 bottom
R48  103.19,60.66 180 bottom
R49  103.19,119.08 0 top
R50  82.87,67.01 180 top
R51  82.87,120.35 0 bottom
R52  103.19,65.74 180 bottom
R53  82.87,122.89 0 bottom
R54  99.38,128.6 90 top
R55  85.41,129.87 270 top
R56  87.95,129.87 270 top
R57  96.84,129.87 270 top
R58  103.19,63.2 180 bottom
R59  86.68,57.48 270 top
R60  100.65,56.21 90 top
R61  98.11,56.21 90 top
R62  89.22,56.21 90 top
R63  92.08,129.87 90 bottom
R64  93.99,56.21 270 bottom
R65  82.87,112.73 0 bottom
R66  93.03,119.71 90 top
R67  103.19,73.36 180 bottom
R68  93.03,66.37 270 top
R69  82.87,115.27 0 bottom
R70  103.19,70.82 180 bottom
R71  102.1,112.32 180 top
R72  83.91,73.71 0 top
R73  94.62,129.87 90 bottom
R74  91.45,56.21 270 bottom
R75  89.54,129.87 90 bottom
R76  102.86,129.87 0 top
R77  96.53,56.21 270 bottom
R78  83.23,56.18 180 top
R79  103.19,126.7 180 bottom
R80  82.87,59.39 0 bottom
R81  103.19,124.16 180 bottom
R82  82.87,61.93 0 bottom
R83  103.19,124.16 0 top
R84  82.87,61.93 180 top
TP1  73.03,87.33 0 top
TP2  113.04,98.76 180 top
TP3  73.03,93.04 0 top
TP4  113.04,93.04 180 top
TP5  55.57,84.47 0 bottom
TP6  130.5,101.61 180 bottom
TP7  55.57,87.01 0 bottom
TP8  130.5,99.07 180 bottom
TP9  55.57,97.17 0 bottom
TP10  130.5,88.91 180 bottom
TP11  87.32,113.04 270 top
TP12  98.75,73.04 90 top
TP13  93.03,113.04 270 top
TP14  93.03,73.04 90 top
TP15  84.46,130.51 90 bottom
TP16  101.61,55.58 270 bottom
TP17  87,130.51 90 bottom
TP18  99.07,55.58 270 bottom
TP19  97.16,130.51 90 bottom
TP20  88.91,55.58 270 bottom
U1  66.36,93.04 90 bottom
U2  119.7,93.04 270 bottom
U3  93.03,119.71 180 bottom
U4  93.03,66.37 0 bottom
VR1  93.55,103.92 180 top
X1  79.14,92.56 90 top

### Tracks (layer width: path | path; a pad name or v marks a point on that pad's centre or on a via)
5V  (via drill 0.6)
  Top 0.254: ICSP.2 101.92,86.44 96,92.35 94.43,92.35 C45.1 93.68,92.19 93.67,92.18 | IC1.4 82.08,93.75 arc-90 C47.1
  Top 0.305: IC1.18 93.37,91.35 93.67,91.64 93.67,92.18 93.67,92.63 93.36,92.94 IC1.20 90.75,92.95 89.93,92.13 86.51,92.13 86.49,92.15 IC1.6 83.86,92.13 84.6,92.13 85.21,92.74 85.21,95.1 | IC1.4 83.87,93.78 | IC1.4 83.9,93.8 84.63,93.8 | 84.63,93.8 84.68,93.8 85.21,94.34 85.21,95.1 | v83.79,97.64 85.21,96.22 85.21,95.1 | JP2.3 87.07,104.91 C41.1 89.4,104.95 93.08,104.95 93.55,105.42 VR1.2 | IC1.4 83.84,93.8 84.63,93.8
  Bottom 0.305: v83.79,97.64 84.73,98.58 JP2.3 | 101.92,83.03 ICSP.2 99.79,82.88 95.95,79.05 92.55,79.05 JP3.2
CS  (via drill 0.5)
  Top 0.254: IC1.14 v89.32,90.58 | v103.22,99.49 103.22,104.95 ICSP1.2
  Bottom 0.254: v89.32,90.58 94.3,90.58 v103.22,99.49
DIR1  (via drill 0.5)
  Top 0.254: v65.09,87.01 65.09,86.69 65.41,86.37 70.49,86.37 70.81,86.69 70.81,99.9 72.08,101.17 73.64,101.17 R31.2
  Bottom 0.254: U1.4 62.43,87.52 62.55,87.64 64.78,87.64 65.09,87.33 v65.09,87.01
DIR2  (via drill 0.41)
  Top 0.254: v87.52,121.13 87.11,121.13 86.4,120.42 86.4,115.62 86.81,115.21 99.66,115.21 101.24,113.64 101.24,112.33 R71.2
  Bottom 0.254: U3.4 87.52,125.22 v87.52,121.13
DIR3  (via drill 0.41)
  Top 0.254: v121.1,98.55 121.1,99.11 120.49,99.72 115.69,99.72 115.21,99.24 115.21,86.61 113.39,84.8 R32.2
  Bottom 0.254: U2.4 125.22,98.58 125.19,98.55 v121.1,98.55
DIR4  (via drill 0.5)
  Top 0.254: v99.07,65.1 99.38,65.1 99.7,65.42 99.7,70.5 99.38,70.82 86.37,70.82 84.76,72.42 R72.2
  Bottom 0.254: U4.4 98.56,62.43 98.43,62.56 98.43,64.78 98.75,65.1 v99.07,65.1
GND  (via drill 0.5)
  Top 0.254: v60.65,101.3 59.38,101.3 58.74,100.66 | 59.38,84.47 59.7,84.15 70.81,84.15 v72.08,82.88 | 59.38,84.47 59.38,90.5 59.06,90.82 v56.2,90.82 | 59.38,84.47 v59.38,82.88 | 84.46,126.7 84.14,126.38 84.14,115.27 v82.87,114 | 84.46,126.7 90.49,126.7 90.81,127.01 v90.81,129.87 | 84.46,126.7 v82.87,126.7 | v125.42,84.79 126.69,84.79 127.32,85.42 129.55,85.42 | 126.69,101.61 126.37,101.93 115.26,101.93 v113.99,103.2 | 126.69,101.61 126.69,95.58 127.01,95.26 v129.86,95.26 | 126.69,101.61 v126.69,103.2 | v84.78,60.66 84.78,59.39 85.41,58.75 | 101.61,59.39 101.92,59.7 101.92,70.82 v103.19,72.09 | 101.61,59.39 95.57,59.39 95.26,59.07 v95.26,56.21 | 101.61,59.39 v103.19,59.39
  Bottom 0.254: R33.2 R23.2 55.35,90.82 | 55.35,90.82 R35.2 | R41.2 C17.2 C9.2 C7.2 C15.2 72.82,104.05 73.35,103.52 73.35,100.98 | 72.08,82.03 R29.2 70.39,82.03 | R25.2 72.08,82.03 | U1.18 60.84,101.11 v60.65,101.3 | C11.2 55.35,100.13 | v56.2,90.82 55.35,90.82 | 72.08,82.03 v72.08,82.88 | 72.89,100.52 U1.19 | C1.2 58.53,83.73 v59.38,82.88 | R73.2 R63.2 90.81,130.72 | 90.81,130.72 R75.2 | C35.2 C27.2 C29.2 C37.2 R81.2 | 82.02,114 R69.2 82.02,115.69 | R65.2 82.02,114 | v90.81,129.87 90.81,130.72 | 82.02,114 v82.87,114 | 81.92,112.73 81.92,111.46 82.24,111.14 | C21.2 83.72,127.55 v82.87,126.7 | R34.2 R24.2 130.71,95.26 | 130.71,95.26 R37.2 | C16.2 C8.2 C10.2 C18.2 R42.2 | 113.99,104.05 R30.2 115.68,104.05 | R27.2 113.99,104.05 | U2.18 125.23,84.98 v125.42,84.79 | C12.2 130.71,85.95 | v129.86,95.26 130.71,95.26 | 113.99,104.05 v113.99,103.2 | C2.2 127.54,102.35 v126.69,103.2 | R74.2 R64.2 95.26,55.36 | 95.26,55.36 R77.2 | R82.2 C38.2 C30.2 C28.2 C36.2 82.02,72.82 82.56,73.36 85.1,73.36 | 104.04,72.09 R70.2 104.04,70.4 | R67.2 104.04,72.09 | U4.18 84.97,60.85 v84.78,60.66 | C32.2 85.95,55.36 | v95.26,56.21 95.26,55.36 | 104.04,72.09 v103.19,72.09 | 85.56,72.89 U4.19 | C22.2 102.34,58.54 v103.19,59.39
  other vias: 101.52,125.53 105.38,112.19 104.39,120.35 86.05,93.85 82.39,92.86 80.61,96.93 112.17,80.64 73.75,105.87 80.14,73.76 99.54,107.59 112.39,105.61 97.58,87.55 80.56,98.83 107.78,87.6 83.67,84.15 94.71,93.45 104.63,91.44 96.94,82.45 96.51,78.38 98.62,97.97 104.56,100.51 106.9,100.66 103.73,97.36
  pour Bottom (rank 2): 53.66,132.16 53.66,53.92 arc90 53.92,53.67 131.51,53.67 arc90 132.68,53.92 132.68,132.41 53.92,132.41 arc90
  pour Top (rank 2): 53.66,53.67 53.66,132.41 132.63,132.41 132.63,53.67
M1  (via drill 2.26)
  Top 1.016: v10.74,93.23 v5.24,98.73 | v10.74,93.23 v5.24,87.74 | v10.74,93.23 v16.24,87.74 | v16.24,98.73 v10.74,93.23
M2  (via drill 2.26)
  Top 0.406: v93.01,175.46 93.47,175.01
  Top 1.016: v87.53,169.96 v93.01,175.46 | v93.01,175.46 v87.53,180.96 | v93.01,175.46 v98.52,180.96 | 93.47,175.01 v98.52,169.96
M3  (via drill 2.26)
  Top 1.016: v169.94,87.44 174.99,92.49 | 174.99,92.49 v175.44,92.94 174.99,93.39 | 174.99,93.39 v169.94,98.43 | v180.93,98.43 175.89,93.39 174.99,93.39 | v180.93,87.44 175.89,92.49 174.99,92.49
M4  (via drill 2.26)
  Top 1.016: v93.01,10.69 v87.52,5.2 | v93.01,10.69 v87.52,16.19 | v98.51,16.19 v93.01,10.69 | v93.01,10.69 v98.51,5.2
MAG1  (via drill 0.5)
  Top 0.254: 74.07,97.89 v73.78,97.8 74.12,97.94 81.3,97.94 83.04,96.15 IC1.1
  Bottom 0.254: U1.22 73.22,98.57 v73.78,97.8
MAG2  (via drill 0.5)
  Top 0.254: IC1.13 v88.54,84.68 | v100.12,91.36 99.48,91.36 95.8,95.05 95.8,97.49 98.06,99.75 98.06,112.07 arc90 v97.88,112.24
  Bottom 0.254: v88.54,84.68 93.44,84.68 v100.12,91.36
  Bottom 0.305: v97.88,112.24 98.56,112.79 U3.22
MAG3  (via drill 0.5)
  Top 0.254: v86.48,85.9 86.13,86.25 IC1.10 | 100.88,93.9 v100.88,93.93 103.29,93.93 108.3,88.93 112.24,88.93 v112.26,88.95
  Bottom 0.254: v100.88,93.93 92.86,85.9 v86.48,85.9
  Bottom 0.305: U2.22 114.17,87.5 112.95,87.5 112.26,88.19 v112.26,88.95
MAG4  (via drill 0.5)
  Top 0.254: v88.12,73.79 88.21,73.9 88.21,77.95 85.33,80.83 IC1.9
  Bottom 0.254: U4.22 87.51,73.23 v88.12,73.79
MISO
  Top 0.254: 90.98,89.01 91.02,89.05 91.66,89.05 100.37,80.34 ICSP.1
  Top 0.305: IC1.16 90.98,89.01
MOSI
  Top 0.254: 90.09,89.01 90.09,87.91 99.23,78.77 105.22,78.77 105.73,79.27 105.73,81.79 104.64,82.88 ICSP.4
  Top 0.305: 90.09,89.01 IC1.15
N$2
  Top 0.406: IC1.7 82.59,91.35 82.59,91.34 79.14,94.79 X1.2 79.11,95 C43.1
N$3
  Top 0.254: R15.1 R16.1 55.35,88.18 55.11,88.42 55.11,96.8 55.14,96.83 55.33,96.83 R17.1 55.14,97.07 55.14,103.38 55.5,103.75 R36.2 55.99,103.84
N$4  (via drill 0.5)
  Top 0.203: v58.23,94.95 56.84,94.95 56.2,95.58 56.2,98.97 R14.2
  Top 0.381: v65.09,94.95 64.46,94.95 63.82,94.31 63.82,93.3 | v65.09,91.14 64.46,91.14 63.82,91.77
  Top 0.406: 63.82,93.3 R26.2 63.82,92.78 63.82,91.77
  Bottom 0.254: U1.10 59.11,95.32 v58.23,94.95
  Bottom 0.381: U1.10 64.72,95.32 v65.09,94.95 | U1.9 64.72,90.77 v65.09,91.14 65.46,90.77 U1.28
N$5  (via drill 0.81)
  Top 0.254: v58.43,85.42 R15.2
  Bottom 0.406: U1.2 59.22,86.22 v58.43,85.42
  Bottom 0.813: TP5.TP 56.52,84.47 57.47,85.42 v58.43,85.42
N$6  (via drill 0.81)
  Top 0.254: v58.43,87.01 58.43,87.33 57.79,87.96 R16.2
  Bottom 0.406: U1.3 58.57,86.87 v58.43,87.01
  Bottom 0.813: v58.43,87.01 TP7.TP
N$7  (via drill 0.5, 0.81)
  Top 0.254: v58.21,96.22 57.69,96.22 R17.2
  Top 0.381: v65.09,96.85 D1.C
  Bottom 0.381: U1.12 64.86,96.62 v65.09,96.85
  Bottom 0.406: U1.12 59.14,96.62 v58.21,96.22
  Bottom 0.813: v58.21,96.22 56.52,96.22 TP9.TP
N$8
  Bottom 0.254: U1.5 57.9,88.17 57.05,89.02 R35.1
N$9
  Bottom 0.254: U1.8 59.13,90.12 58.74,90.5 58.74,93.04 58.11,93.68 57.47,93.68 57.05,94.1 R33.1 57.05,94.73
N$10  (via drill 0.5)
  Top 0.254: v68.27,103.2 67.42,104.05 R9.2
  Bottom 0.254: U1.24 69.76,97.27 69.54,97.49 69.54,98.12 68.9,98.76 68.9,100.03 68.27,100.66 v68.27,103.2
N$11
  Bottom 0.254: U1.33 69.73,87.52 69.54,87.33 69.54,84.15 69.96,83.73 R29.1
N$12
  Bottom 0.254: U1.34 70.35,86.87 70.17,86.69 70.17,84.79 72.71,84.79 73.35,84.15 R25.1
N$13
  Bottom 0.254: U1.7 58.51,89.47 58.11,89.87 58.11,91.45 57.47,92.09 R23.1
N$14
  Bottom 0.254: U1.26 68.52,95.97 68.27,96.22 68.27,96.85 67.63,97.49 67.63,98.76 64.46,101.93 C17.1
N$15
  Bottom 0.254: U1.27 67.9,95.32 67.63,95.58 67.63,96.22 67,96.85 67,98.12 63.82,101.3 62.55,101.3 61.92,101.93 R41.1
N$16
  Bottom 0.254: U1.30 67.87,89.47 67.63,89.23 67.63,86.06 67,85.42 65.73,85.42 65.09,84.79 64.46,84.79 63.4,83.73 R13.1
N$17
  Bottom 0.254: U1.31 68.49,88.82 68.27,88.6 68.27,85.42 67.63,84.79 66.36,84.79 65.73,84.15 R11.1
N$18  (via drill 0.5)
  Top 0.254: v65.73,103.2 66.58,102.35 C9.1
  Bottom 0.254: U1.25 69.14,96.62 68.9,96.85 68.9,97.49 68.27,98.12 68.27,99.39 67,100.66 C9.1 66.58,102.35 v65.73,103.2
N$19
  Bottom 0.254: U1.32 69.11,88.17 68.9,87.96 68.9,84.37 R5.1
N$20
  Bottom 0.254: U1.23 70.38,97.92 70.17,98.12 70.17,98.76 69.54,99.39 C7.1
N$21
  Bottom 0.254: U1.29 67.25,90.12 67,89.87 67,86.69 66.36,86.06 65.09,86.06 64.46,85.42 63.82,85.42 63.19,84.79 61.28,84.79 60.65,84.15 R6.1
N$22  (via drill 0.5)
  Top 0.254: R43.1 C19.1 59.28,102.45 v57.79,102.45
  Bottom 0.254: U1.16 59.55,99.22 58.74,100.03 58.74,101.72 C19.1 59.28,102.45 v57.79,102.45
N$23  (via drill 0.5)
  Top 0.254: v94.94,127.84 94.94,129.24 95.57,129.87 98.96,129.87 R54.2
  Top 0.381: v94.94,120.98 94.94,121.62 94.3,122.25 93.29,122.25 | v91.13,120.98 91.13,121.62 91.76,122.25
  Top 0.406: 93.29,122.25 R66.2 92.77,122.25 91.76,122.25
  Bottom 0.254: U3.10 95.31,126.96 v94.94,127.84
  Bottom 0.381: U3.10 95.31,121.35 v94.94,120.98 | U3.9 90.76,121.35 v91.13,120.98 90.76,120.61 U3.28
N$24  (via drill 0.5)
  Top 0.254: C13.1 56.82,102.05 v57.79,101.08
  Bottom 0.254: U1.15 58.93,98.57 58.74,98.76 58.74,99.07 58.11,99.71 58.11,100.64 57.79,100.95 v57.79,101.08 56.82,102.05 C13.1
N$25  (via drill 0.5)
  Top 0.254: R14.1 58.26,99.33 v58.26,97.51
  Bottom 0.254: U1.14 59.17,97.92 58.77,97.51 v58.26,97.51 58.26,98.6 57.47,99.39 57.37,99.39 C11.1 57.05,99.81
N$26
  Bottom 0.254: U1.20 70.33,99.87 70.17,100.03 70.17,101.3 71.23,102.35 C15.1
N$27  (via drill 0.81)
  Top 0.254: v85.41,127.65 R55.2
  Bottom 0.406: U3.2 86.21,126.85 v85.41,127.65
  Bottom 0.813: TP15.TP 84.46,129.55 85.41,128.6 v85.41,127.65
N$28  (via drill 0.81)
  Top 0.254: v87,127.65 87.32,127.65 87.95,128.28 R56.2
  Bottom 0.406: U3.3 86.86,127.51 v87,127.65
  Bottom 0.813: v87,127.65 TP17.TP
N$29  (via drill 0.5, 0.81)
  Top 0.254: v96.21,127.84 96.21,128.39 R57.2
  Top 0.381: D3.C v96.84,120.98
  Bottom 0.381: U3.12 96.61,121.22 v96.84,120.98
  Bottom 0.406: U3.12 96.61,126.93 v96.21,127.84
  Bottom 0.813: v96.21,127.84 96.21,129.3 TP19.TP
N$30
  Bottom 0.254: U3.5 88.16,128.17 89.01,129.02 R75.1
N$31
  Bottom 0.254: U3.8 90.11,126.95 90.49,127.33 93.03,127.33 93.67,127.97 93.67,128.6 94.09,129.02 R73.1 94.72,129.02
N$32
  Bottom 0.254: U3.33 87.51,116.35 87.32,116.54 84.14,116.54 83.72,116.12 R69.1
N$33
  Bottom 0.254: U3.34 86.86,115.73 86.68,115.9 84.78,115.9 84.78,113.36 84.14,112.73 R65.1
N$34
  Bottom 0.254: U3.7 89.46,127.57 89.86,127.97 91.45,127.97 92.08,128.6 R63.1
N$35
  Bottom 0.254: U3.26 95.96,117.56 96.21,117.81 96.84,117.81 97.48,118.44 98.75,118.44 101.92,121.62 C37.1
N$36
  Bottom 0.254: U3.27 95.31,118.18 95.57,118.44 96.21,118.44 96.84,119.08 98.11,119.08 101.29,122.25 101.29,123.52 101.92,124.16 R81.1
N$37
  Bottom 0.254: U3.30 89.46,118.21 89.22,118.44 86.05,118.44 85.41,119.08 85.41,120.35 84.78,120.98 84.78,121.62 83.72,122.67 R53.1
N$38
  Bottom 0.254: U3.31 88.81,117.59 88.59,117.81 85.41,117.81 84.78,118.44 84.78,119.71 84.14,120.35 R51.1
N$39  (via drill 0.5)
  Top 0.254: v103.19,117.81 104.04,118.66 R49.2
  Bottom 0.254: U3.24 97.26,116.32 97.48,116.54 98.11,116.54 98.75,117.17 100.02,117.17 100.65,117.81 v103.19,117.81
N$40  (via drill 0.5)
  Top 0.254: v103.19,120.35 102.34,119.5 C29.1
  Bottom 0.254: U3.25 96.61,116.94 96.84,117.17 97.48,117.17 98.11,117.81 99.38,117.81 100.65,119.08 C29.1 102.34,119.5 v103.19,120.35
N$41
  Bottom 0.254: U3.23 97.91,115.7 98.11,115.9 98.75,115.9 99.38,116.54 C27.1
N$42
  Bottom 0.254: U3.32 88.16,116.97 87.95,117.17 84.36,117.17 R45.1
N$43
  Bottom 0.254: U3.29 90.11,118.83 89.86,119.08 86.68,119.08 86.05,119.71 86.05,120.98 85.41,121.62 85.41,122.25 84.78,122.89 84.78,124.79 84.14,125.43 R46.1
N$44
  Top 0.254: R55.1 R56.1 88.12,130.89 96.44,130.89 96.6,130.72 R57.1 arc-90 97.01,130.89 103.45,130.89 103.83,130.51 103.83,130.09 R76.2
N$45  (via drill 0.5)
  Top 0.254: C33.1 102,129.86 | C33.1 101.97,129.83 | v101.44,128.32 102.01,128.89 C33.1
  Bottom 0.254: U3.15 98.56,127.14 98.75,127.33 99.07,127.33 99.7,127.97 101.29,127.97 101.44,128.12 v101.44,128.32 102.01,128.89 C33.1
N$46  (via drill 0.5)
  Top 0.254: R54.1 99.29,127.84 v97.5,127.84
  Bottom 0.254: U3.14 97.91,126.9 97.5,127.31 v97.5,127.84 97.63,127.97 98.75,127.97 99.38,128.6 99.38,128.7 C31.1 99.8,129.02
N$47  (via drill 0.5)
  Top 0.254: R83.1 C39.1 102.34,128.03 v102.57,128.26
  Bottom 0.254: U3.16 99.21,126.52 100.02,127.33 101.71,127.33 C39.1 102.34,128.03 v102.57,128.26
N$48
  Bottom 0.254: U3.20 99.86,115.74 100.02,115.9 101.29,115.9 102.34,114.85 C35.1
N$49  (via drill 0.5)
  Top 0.203: v127.32,91.14 129.23,91.14 129.86,90.5 129.86,87.11 R19.2
  Top 0.381: v120.97,91.14 121.61,91.14 122.24,91.77 122.24,92.78 | v120.97,94.95 121.61,94.95 122.24,94.31
  Top 0.406: 122.24,92.78 R28.2 122.24,93.3 122.24,94.31
  Bottom 0.254: U2.10 126.95,90.77 v127.32,91.14
  Bottom 0.381: U2.10 121.34,90.77 v120.97,91.14 | U2.9 121.34,95.32 v120.97,94.95 120.6,95.32 U2.28
N$50  (via drill 0.81)
  Top 0.254: v127.64,100.66 R20.2
  Bottom 0.406: U2.2 126.85,99.87 v127.64,100.66
  Bottom 0.813: TP6.TP 129.55,101.61 128.59,100.66 v127.64,100.66
N$51  (via drill 0.81)
  Top 0.254: v127.64,99.07 127.64,98.76 128.28,98.12 R21.2
  Bottom 0.406: U2.3 127.5,99.22 v127.64,99.07
  Bottom 0.813: v127.64,99.07 TP8.TP
N$52  (via drill 0.5, 0.81)
  Top 0.254: v127.64,89.87 128.38,89.87 R22.2
  Top 0.381: D2.C v120.97,89.23
  Bottom 0.381: U2.12 121.21,89.47 v120.97,89.23
  Bottom 0.406: U2.12 126.92,89.47 v127.64,89.87
  Bottom 0.813: v127.64,89.87 128.59,88.91 TP10.TP
N$53
  Bottom 0.254: U2.5 128.16,97.92 129.01,97.07 R37.1
N$54
  Bottom 0.254: U2.8 126.94,95.97 127.32,95.58 127.32,93.04 127.96,92.41 128.59,92.41 129.01,91.99 R34.1 129.01,91.35
N$55
  Bottom 0.254: U2.33 116.34,98.57 116.53,98.76 116.53,101.93 116.11,102.35 R30.1
N$56
  Bottom 0.254: U2.34 115.72,99.22 115.89,99.39 115.89,101.3 113.35,101.3 112.72,101.93 R27.1
N$57
  Bottom 0.254: U2.7 127.56,96.62 127.96,96.22 127.96,94.63 128.59,93.99 R24.1
N$58
  Bottom 0.254: U2.26 117.55,90.12 117.8,89.87 117.8,89.23 118.43,88.6 118.43,87.33 121.61,84.15 C18.1
N$59
  Bottom 0.254: U2.27 118.17,90.77 118.43,90.5 118.43,89.87 119.07,89.23 119.07,87.96 122.24,84.79 123.51,84.79 124.15,84.15 R42.1
N$60
  Bottom 0.254: U2.30 118.2,96.62 118.43,96.85 118.43,100.03 119.07,100.66 120.34,100.66 120.97,101.3 121.61,101.3 122.66,102.35 R18.1
N$61
  Bottom 0.254: U2.31 117.58,97.27 117.8,97.49 117.8,100.66 118.43,101.3 119.7,101.3 120.34,101.93 R12.1
N$62  (via drill 0.5)
  Top 0.254: v117.8,82.88 118.65,82.03 R10.2
  Bottom 0.254: U2.24 116.31,88.82 116.53,88.6 116.53,87.96 117.16,87.33 117.16,86.06 117.8,85.42 v117.8,82.88
N$63  (via drill 0.5)
  Top 0.254: v120.34,82.88 119.49,83.73 C10.1
  Bottom 0.254: U2.25 116.93,89.47 117.16,89.23 117.16,88.6 117.8,87.96 117.8,86.69 119.07,85.42 C10.1 119.49,83.73 v120.34,82.88
N$64
  Bottom 0.254: U2.23 115.69,88.17 115.89,87.96 115.89,87.33 116.53,86.69 C8.1
N$65
  Bottom 0.254: U2.32 116.96,97.92 117.16,98.12 117.16,101.72 R7.1
N$66
  Bottom 0.254: U2.29 118.82,95.97 119.07,96.22 119.07,99.39 119.7,100.03 120.97,100.03 121.61,100.66 122.24,100.66 122.88,101.3 124.78,101.3 125.42,101.93 R8.1
N$67
  Top 0.254: R20.1 R21.1 131.01,97.83 131.01,89.23 R22.1 130.71,89.07 131.03,88.75 131.03,82.78 130.5,82.25 130.08,82.25 R38.2
N$68  (via drill 0.5)
  Top 0.254: v128.21,84.62 129.06,83.98 C14.1
  Bottom 0.254: U2.15 127.13,87.52 127.32,87.33 127.32,87.01 128.03,86.3 128.03,85.12 128.21,84.94 v128.21,84.62 129.06,83.98 C14.1
N$69  (via drill 0.5)
  Top 0.254: v127.32,88.6 127.32,87.11 R19.1
  Bottom 0.254: U2.14 126.89,88.17 v127.32,88.6 127.96,87.96 127.96,87.33 128.59,86.69 128.7,86.69 C12.1 129.01,86.27
N$70  (via drill 0.5)
  Top 0.254: R44.1 126.43,83.73 C20.1 126.7,83.92 127.22,83.92 127.81,83.34 v128.21,83.34
  Bottom 0.254: U2.16 126.51,86.87 127.37,86 127.37,84.53 126.83,83.98 R40.1 126.75,83.92 127.4,83.92 127.98,83.34 v128.21,83.34
N$71
  Bottom 0.254: U2.20 115.73,86.22 115.89,86.06 115.89,84.79 114.84,83.73 C16.1
N$72  (via drill 0.5)
  Top 0.203: v91.13,58.75 91.13,56.85 90.49,56.21 87.1,56.21 R59.2
  Top 0.381: v91.13,65.1 91.13,64.47 91.76,63.83 92.77,63.83 | v94.94,65.1 94.94,64.47 94.3,63.83
  Top 0.406: 92.77,63.83 R68.2 93.29,63.83 94.3,63.83
  Bottom 0.254: U4.10 90.76,59.12 v91.13,58.75
  Bottom 0.381: U4.10 90.76,64.73 v91.13,65.1 | U4.9 95.31,64.73 v94.94,65.1 95.31,65.47 U4.28
N$73  (via drill 0.81)
  Top 0.254: v100.65,58.43 R60.2
  Bottom 0.406: U4.2 99.86,59.23 v100.65,58.43
  Bottom 0.813: TP16.TP 101.61,56.53 100.65,57.48 v100.65,58.43
N$74  (via drill 0.81)
  Top 0.254: v99.07,58.43 98.75,58.43 98.11,57.8 R61.2
  Bottom 0.406: U4.3 99.21,58.58 v99.07,58.43
  Bottom 0.813: v99.07,58.43 TP18.TP
N$75  (via drill 0.5, 0.81)
  Top 0.254: v89.86,58.43 89.86,57.7 R62.2
  Top 0.381: D4.C v89.22,65.1
  Bottom 0.381: U4.12 89.46,64.87 v89.22,65.1
  Bottom 0.406: U4.12 89.46,59.15 v89.86,58.43
  Bottom 0.813: v89.86,58.43 88.91,57.48 TP20.TP
N$76
  Bottom 0.254: U4.5 97.91,57.91 97.06,57.06 R77.1
N$77
  Bottom 0.254: U4.8 95.96,59.14 95.57,58.75 93.03,58.75 92.4,58.12 92.4,57.48 91.98,57.06 R74.1 91.34,57.06
N$78
  Bottom 0.254: U4.33 98.56,69.74 98.75,69.55 101.92,69.55 102.34,69.97 R70.1
N$79
  Bottom 0.254: U4.34 99.21,70.36 99.38,70.18 101.29,70.18 101.29,72.72 101.92,73.36 R67.1
N$80
  Bottom 0.254: U4.7 96.61,58.52 96.21,58.12 94.62,58.12 93.99,57.48 R64.1
N$81
  Bottom 0.254: U4.26 90.11,68.53 89.86,68.28 89.22,68.28 88.59,67.64 87.32,67.64 84.14,64.47 C38.1
N$82
  Bottom 0.254: U4.27 90.76,67.91 90.49,67.64 89.86,67.64 89.22,67.01 87.95,67.01 84.78,63.83 84.78,62.56 84.14,61.93 R82.1
N$83
  Bottom 0.254: U4.30 96.61,67.88 96.84,67.64 100.02,67.64 100.65,67.01 100.65,65.74 101.29,65.1 101.29,64.47 102.34,63.41 R58.1
N$84
  Bottom 0.254: U4.31 97.26,68.5 97.48,68.28 100.65,68.28 101.29,67.64 101.29,66.37 101.92,65.74 R52.1
N$85  (via drill 0.5)
  Top 0.254: v82.87,68.28 82.02,67.43 R50.2
  Bottom 0.254: U4.24 88.81,69.77 88.59,69.55 87.95,69.55 87.32,68.91 86.05,68.91 85.41,68.28 v82.87,68.28
N$86  (via drill 0.5)
  Top 0.254: v82.87,65.74 83.72,66.59 C30.1
  Bottom 0.254: U4.25 89.46,69.15 89.22,68.91 88.59,68.91 87.95,68.28 86.68,68.28 85.41,67.01 C30.1 83.72,66.59 v82.87,65.74
N$87
  Bottom 0.254: U4.23 88.16,70.39 87.95,70.18 87.32,70.18 86.68,69.55 C28.1
N$88
  Bottom 0.254: U4.32 97.91,69.12 98.11,68.91 101.71,68.91 R47.1
N$89
  Bottom 0.254: U4.29 95.96,67.26 96.21,67.01 99.38,67.01 100.02,66.37 100.02,65.1 100.65,64.47 100.65,63.83 101.29,63.2 101.29,61.29 101.92,60.66 R48.1
N$90
  Top 0.254: R60.1 R61.1 97.9,55.14 89.44,55.14 arc-90 R62.1 88.98,55.36 88.74,55.12 82.7,55.12 82.24,55.58 82.24,56 R78.2
N$91  (via drill 0.5)
  Top 0.254: v84.99,57.86 84.99,57.48 R78.1
  Bottom 0.254: U4.15 87.51,58.94 87.32,58.75 87,58.75 86.37,58.12 85.29,58.12 v84.99,57.86 84.99,57.48 C34.1
N$92  (via drill 0.5)
  Top 0.254: v88.59,58.75 87.1,58.75 R59.1
  Bottom 0.254: U4.14 88.16,59.18 v88.59,58.75 87.95,58.12 87.32,58.12 86.68,57.48 86.68,57.38 C32.1 86.26,57.06
N$93  (via drill 0.5)
  Top 0.254: R84.1 C40.1 83.72,57.85 v83.7,57.86
  Bottom 0.254: U4.16 86.86,59.56 86.05,58.75 84.36,58.75 C40.1 83.72,57.85 v83.7,57.86
N$94
  Bottom 0.254: U4.20 86.21,70.34 86.05,70.18 84.78,70.18 83.72,71.24 C36.1
N$95
  Top 0.406: IC1.8 79.14,90.55 X1.1 79.06,90.14 C44.1
N$96
  Top 0.61: D5.C 89.13,107.02 VR1.3
PC3  (via drill 0.5)
  Top 0.254: IC1.25 v94.79,97.64 | v97.1,97.61 101.92,102.44 ICSP1.1
  Bottom 0.254: v94.79,97.64 97.07,97.64 v97.1,97.61
RANGE  (via drill 0.5)
  Top 0.305: IC1.23 92.52,95.25 92.42,95.35 91,95.35 89.35,93.7 v89.35,92.94
  Bottom 0.305: v89.35,92.94 84.47,88.06 84.47,84.43 88.18,80.72 JP3.1
RST  (via drill 0.5)
  Top 0.254: 105.12,84.56 105.3,84.56 108.22,84.56 108.73,84.05 108.73,81.23 107.84,80.34 ICSP.5
  Top 0.305: v88.49,95.25 87.73,96.01 IC1.29 | v93.72,95.2 94.48,95.2 105.12,84.56 105.3,84.56
  Bottom 0.305: v93.72,95.2 93.67,95.25 v88.49,95.25
RX  (via drill 0.5)
  Top 0.254: v87.42,94.11 86.93,94.6 IC1.30 | v96.97,95.05 102.86,95.05 108.2,100.38 108.2,102.54 107.03,103.71 ICSP1.5
  Bottom 0.254: v96.97,95.05 96.31,94.39 88.18,94.39 87.9,94.11 v87.42,94.11
SCK
  Top 0.254: IC1.17 92.27,90.39 | 92.32,90.34 101.03,81.64 103.09,81.64 104.39,80.34 ICSP.3
  Top 0.305: 92.27,90.39 92.32,90.34
SCL_MCU
  Top 0.305: IC1.28 88.51,97.66 88.51,98.53 87.17,99.87 80.49,99.87 79.65,100.71 JP2.1
SDA_MCU
  Top 0.305: IC1.27 89.3,97.67 89.3,98.83 87.7,100.43 83.15,100.43 82.19,101.4 JP2.2
TX  (via drill 0.5)
  Top 0.254: v86.15,98.96 86.15,97.66 IC1.31
  Bottom 0.254: ICSP1.3 104.46,103.58 100.14,99.26 86.45,99.26 v86.15,98.96
V+  (via drill 0.5, 0.6)
  Top 0.203: 63.19,99.71 v62.87,99.39 | 102.88,122.89 103.19,123.2 | v99.38,123.2 99.7,122.89 | v125.42,82.88 123.2,82.88 122.88,83.2 122.88,86.37 v123.2,86.69 | v82.87,60.66 82.87,62.88 83.19,63.2 86.37,63.2 v86.68,62.88
  Top 0.254: v62.87,99.39 C4.1 | v60.65,103.2 62.87,103.2 63.19,102.88 63.19,99.71 | C24.1 v99.38,123.2 | 103.19,123.2 v103.19,125.43 | 99.7,122.89 102.88,122.89 | v123.2,86.69 C6.1 | C26.1 v86.68,62.88
  Top 0.381: C3.+ 63.19,87.47 | v63.82,86.69 62.55,85.42 | 87.46,122.89 C23.+ | v86.68,122.25 85.41,123.52 | C5.+ 122.88,98.62 | v122.24,99.39 123.51,100.66 | C25.+ 98.61,63.2 | v99.38,63.83 100.65,62.56
  Top 0.61: C42.1 83.26,106.96 83.32,107.01 D5.A 85.09,106.93 v86.94,106.93
  Top 0.813: TP1.TP 73.03,85.57 73.18,85.74 v73.98,85.42 | TP11.TP 85.56,113.04 85.73,112.9 v85.41,112.09 | TP2.TP 113.04,100.52 112.89,100.34 v112.08,100.66 | TP12.TP 100.51,73.04 100.34,73.18 v100.65,73.99
  Top 1.016: v73.98,85.42 63.82,85.42 | v85.41,112.09 85.41,122.25 | v112.08,100.66 122.24,100.66 | v100.65,73.99 100.65,63.83
  Bottom 0.254: U1.17 62.4,99.87 v62.87,99.39 | R39.2 59.8,104.05 v60.65,103.2 | U3.17 99.86,123.68 v99.38,123.2 | R79.2 104.04,126.28 v103.19,125.43 | U2.17 123.67,86.22 v123.2,86.69 | R40.2 126.27,82.03 v125.42,82.88 | U4.17 86.21,62.4 v86.68,62.88 | R80.2 82.02,59.81 v82.87,60.66
  Bottom 0.381: U1.36 73.84,85.57 v73.98,85.42 | U1.1 62.7,85.57 v63.82,86.69 | U3.36 85.56,112.24 v85.41,112.09 | U3.1 85.56,123.38 v86.68,122.25 | U2.36 112.23,100.52 v112.08,100.66 | U2.1 123.37,100.52 v122.24,99.39 | U4.36 100.51,73.85 v100.65,73.99 | U4.1 100.51,62.71 v99.38,63.83
  Bottom 0.813: 85.34,110.26 86.94,110.26 v86.94,106.93
  Bottom 1.397: JP1.2 77.62,106.17 | JP1.2 77.64,106.17 77.64,106.15 78.55,105.23 79.19,105.23 84.32,110.26 85.34,110.26 | JP1.2 76.96,106.69 | 110.03,105.64 110,80.44 105.63,75.79 100.27,75.79 | 100.27,75.79 100.68,75.39 | 100.17,75.79 80.56,75.79 75.81,80.54 75.81,85.34 | 100.17,75.79 100.27,75.79 | 100.17,75.79 100.65,75.31 v100.65,73.99 | v112.08,100.66 110.3,100.66 110.3,105.66 110.28,105.69 110.28,105.82 105.38,110.26 85.34,110.26 | 75.81,85.34 75.81,105.58 76.81,106.58 JP1.2 | v73.98,85.42 75.74,85.42 75.81,85.34 | v85.41,112.09 85.41,110.34 arc-90 85.34,110.26
  pour Top (no thermals): 65.09,84.79 60.01,84.79 60.01,100.66 65.09,100.66 65.09,98.12 61.92,98.12 61.92,90.5 65.09,90.5
  pour Top (no thermals): 84.78,120.98 84.78,126.06 100.65,126.06 100.65,120.98 98.11,120.98 98.11,124.16 90.49,124.16 90.49,120.98
  pour Top (no thermals): 120.97,101.3 126.05,101.3 126.05,85.42 120.97,85.42 120.97,87.96 124.15,87.96 124.15,95.58 120.97,95.58
  pour Top (no thermals): 101.29,65.1 101.29,60.02 85.41,60.02 85.41,65.1 87.95,65.1 87.95,61.93 95.57,61.93 95.57,65.1
V-  (via drill 0.5)  (3 unrouted)
  Top 0.203: v91.45,73.99 92.98,73.99 93.01,73.97
  Top 0.254: C19.2 R43.2 64.56,104.05 64.78,103.84 64.78,102.88 65.73,101.93 65.73,100.79 C4.2 | C19.2 arc90 59.28,104.15 | C39.2 R83.2 104.04,121.51 103.83,121.3 102.88,121.3 101.92,120.35 100.78,120.35 C24.2 | C39.2 arc90 104.15,126.8 | C20.2 arc90 126.79,81.93 | C6.2 120.34,85.29 120.34,84.15 121.29,83.2 121.29,82.25 121.51,82.03 R44.2 124.39,81.79 126.31,81.79 126.66,82.14 C20.2 | C26.2 85.28,65.74 84.14,65.74 83.19,64.78 82.24,64.78 82.02,64.57 R84.2 C40.2 arc90 81.92,59.28 82.38,58.83 v82.38,57.86 | 73.12,93.07 73.98,93.93 v73.98,94.63 73.98,93.12 74.03,93.07 76.27,93.07 76.32,93.02 | v91.45,73.99 91.55,73.89 93.01,73.89 | C20.2 126.71,82.13 v128.21,82.13 | v103.71,128.26 104.04,127.93 C39.2 | v57.77,103.77 59.1,103.77 C19.2
  Top 0.813: 73.98,93.04 v73.98,91.45 | v73.98,94.63 73.98,93.04 | 73.98,93.04 TP3.TP | 93.03,112.09 v91.45,112.09 | 93.03,112.09 v94.62,112.09 | 93.03,112.09 TP13.TP | 112.08,93.04 v112.08,94.63 | 112.08,93.04 v112.08,91.45 | TP4.TP 112.08,93.04 | 93.03,73.99 v94.62,73.99 | v91.45,73.99 93.03,73.99 | 93.03,73.99 TP14.TP
  Top 1.397: TP14.TP 93.06,73.06 | TP4.TP 112.78,92.79 110.13,92.79 | 93.03,109.96 93.03,112.09 | R4.2 106.29,109.83 110.13,105.99 110.13,92.79 | 75.74,93.07 74.03,93.07 73.12,93.07 | 110.13,92.79 110.13,90.33 R2.2 | R3.1 80.01,76.05 L1.P$2 76.32,79.74 76.32,93.02 76.32,96.54 R1.1 | 92.75,76 106.09,76 110.1,80.01 110.1,87.09 R2.1 | 93.01,73.97 93.01,75.74 92.75,76 | 80.56,106.65 JP1.1 80.39,109.8 | 83.28,109.96 93.03,109.96 | 80.56,106.65 83.28,109.37 83.28,109.96 | 83.28,109.96 80.54,109.96 | 92.75,76 90.2,76 arc-90 R3.2 | 93.03,109.96 95.99,109.96 arc-90 R4.1 | R1.2 76.09,102.18 80.56,106.65
  Bottom 0.254: C14.2 129.44,82.03 129.34,81.93 128.45,81.93 v128.21,82.13 | v103.71,128.26 C33.2 | C13.2 57.74,103.75 v57.77,103.77 | C34.2 82.35,57.8 v82.38,57.86
  Bottom 0.381: U1.13 63.6,97.27 64.46,98.12 65.73,98.12 66.36,97.49 v66.36,93.68 | U3.13 97.26,122.47 98.11,121.62 98.11,120.35 97.48,119.71 v93.67,119.71 | U2.13 122.46,88.82 121.61,87.96 120.34,87.96 119.7,88.6 v119.7,92.41 | U4.13 88.81,63.61 87.95,64.47 87.95,65.74 88.59,66.37 v92.4,66.37
  other vias: 66.36,92.41 67.63,92.41 67.63,93.68 92.4,119.71 92.4,118.44 93.67,118.44 119.7,93.68 118.43,93.68 118.43,92.41 93.67,66.37 93.67,67.64 92.4,67.64
  pour Bottom (no thermals): 59.38,94.95 74.3,94.95 74.3,91.14 59.38,91.14
  pour Top (no thermals): 65.73,100.66 65.73,87.01 70.17,87.01 70.17,100.66
  pour Bottom (no thermals): 94.94,126.7 94.94,111.77 91.13,111.77 91.13,126.7
  pour Top (no thermals): 100.65,120.35 87,120.35 87,115.9 100.65,115.9
  pour Bottom (no thermals): 126.69,91.14 111.77,91.14 111.77,94.95 126.69,94.95
  pour Top (no thermals): 120.34,85.42 120.34,99.07 115.89,99.07 115.89,85.42
  pour Bottom (no thermals): 91.13,59.39 91.13,74.31 94.94,74.31 94.94,59.39
  pour Top (no thermals): 85.41,65.74 99.07,65.74 99.07,70.18 85.41,70.18
VR1  (via drill 0.5)
  Top 0.254: v69.54,82.88 70.49,81.93 74.62,81.93 74.85,82.16 74.85,88.68 74.62,88.91 71.76,88.91 71.44,89.23 71.44,98.76 71.76,99.07 73.6,99.07 v73.78,99.3
  Bottom 0.254: v69.54,82.88 68.69,82.03 R5.2 R11.2 R13.2 R6.2 60.55,81.93 58.11,81.93 C1.1 | v73.78,99.3 73.87,99.29 U1.21
VR2  (via drill 0.5)
  Top 0.254: v82.87,116.54 81.92,115.58 81.92,111.46 82.24,111.14 88.59,111.14 88.91,111.46 88.91,114.31 89.22,114.63 98.75,114.63 99.07,114.31 v99.09,112.24
  Bottom 0.254: v82.87,116.54 82.02,117.39 R45.2 R51.2 R53.2 R46.2 81.92,125.53 81.92,127.97 C21.1 | v99.09,112.24 99.21,112.23 U3.21
VR3  (via drill 0.5)
  Top 0.254: v116.53,103.2 115.58,104.15 111.45,104.15 111.23,103.89 111.23,97.54 111.45,97.17 114.31,97.17 114.62,96.85 114.62,87.33 114.31,87.01 v112.36,87.01
  Bottom 0.254: v116.53,103.2 117.38,104.05 R7.2 R12.2 R18.2 R8.2 125.52,104.15 127.96,104.15 C2.1 | v112.36,87.01 112.23,86.87 U2.21
VR4  (via drill 0.5)
  Top 0.254: v103.19,69.55 104.15,70.5 104.15,74.63 103.83,74.94 97.48,74.94 97.16,74.63 97.16,71.77 96.84,71.45 87.32,71.45 86.86,71.91 v86.86,73.85
  Bottom 0.254: v103.19,69.55 104.04,68.7 R47.2 R52.2 R58.2 R48.2 104.15,60.55 104.15,58.12 C22.1 | v86.86,73.85 U4.21
WIFI_EN  (via drill 0.5)
  Top 0.254: IC1.12 87.73,87.69 v87.42,87.38 | v105.76,99.52 105.76,104.95 ICSP1.4
  Bottom 0.254: v87.42,87.38 92.4,87.38 104.44,99.42 105.66,99.42 v105.76,99.52
WIFI_IRQ  (via drill 0.5)
  Top 0.254: IC1.32 85.31,97.62 85.31,96.95 85.79,96.47 85.79,95.5 v86.05,95.25
  Bottom 0.254: ICSP1.6 107.76,106.25 108.68,105.33 108.68,102.9 107.54,101.75 103.75,101.75 98.16,96.16 86.96,96.16 v86.05,95.25

### Text on the board
tPlace: DNP For CW | + | CS | EN | IRQ | DNP For CW | PC3 | TX | RX | nullspacelabs | nullspacelabs | 5V | MO | GND | DNP For CW | MI | SCK | RST | DNP For CW
bPlace: nullspacelabs | nullspacelabs